# Altium project FIT_PM_Dual_Range_AFE.PrjPcb (part 4 of 8)

## Sheet AFE.SchDoc: FIT_PM12 board
size 420 x 297 mm; CheckedBy: G.Kasprowicz; Author: INR Moscow; CompanyName: WUT ISE; DrawnBy: M.Podgórski; Organization: WUT ISE; Address1: PW ISE; Address2: Nowowiejska 15/19 00-665 Warsaw; Address3: gkasprow@gmail.com; DocumentNumber: 2; Revision: 2; SheetNumber: 4; SheetTotal: 21; ModifiedBy: -; CheckedDate: -; Title2: AFEs; DivGrp: WUT ISE; Designer: INR RAS; ModifiedDate: -; ProjectName: Sensor Box
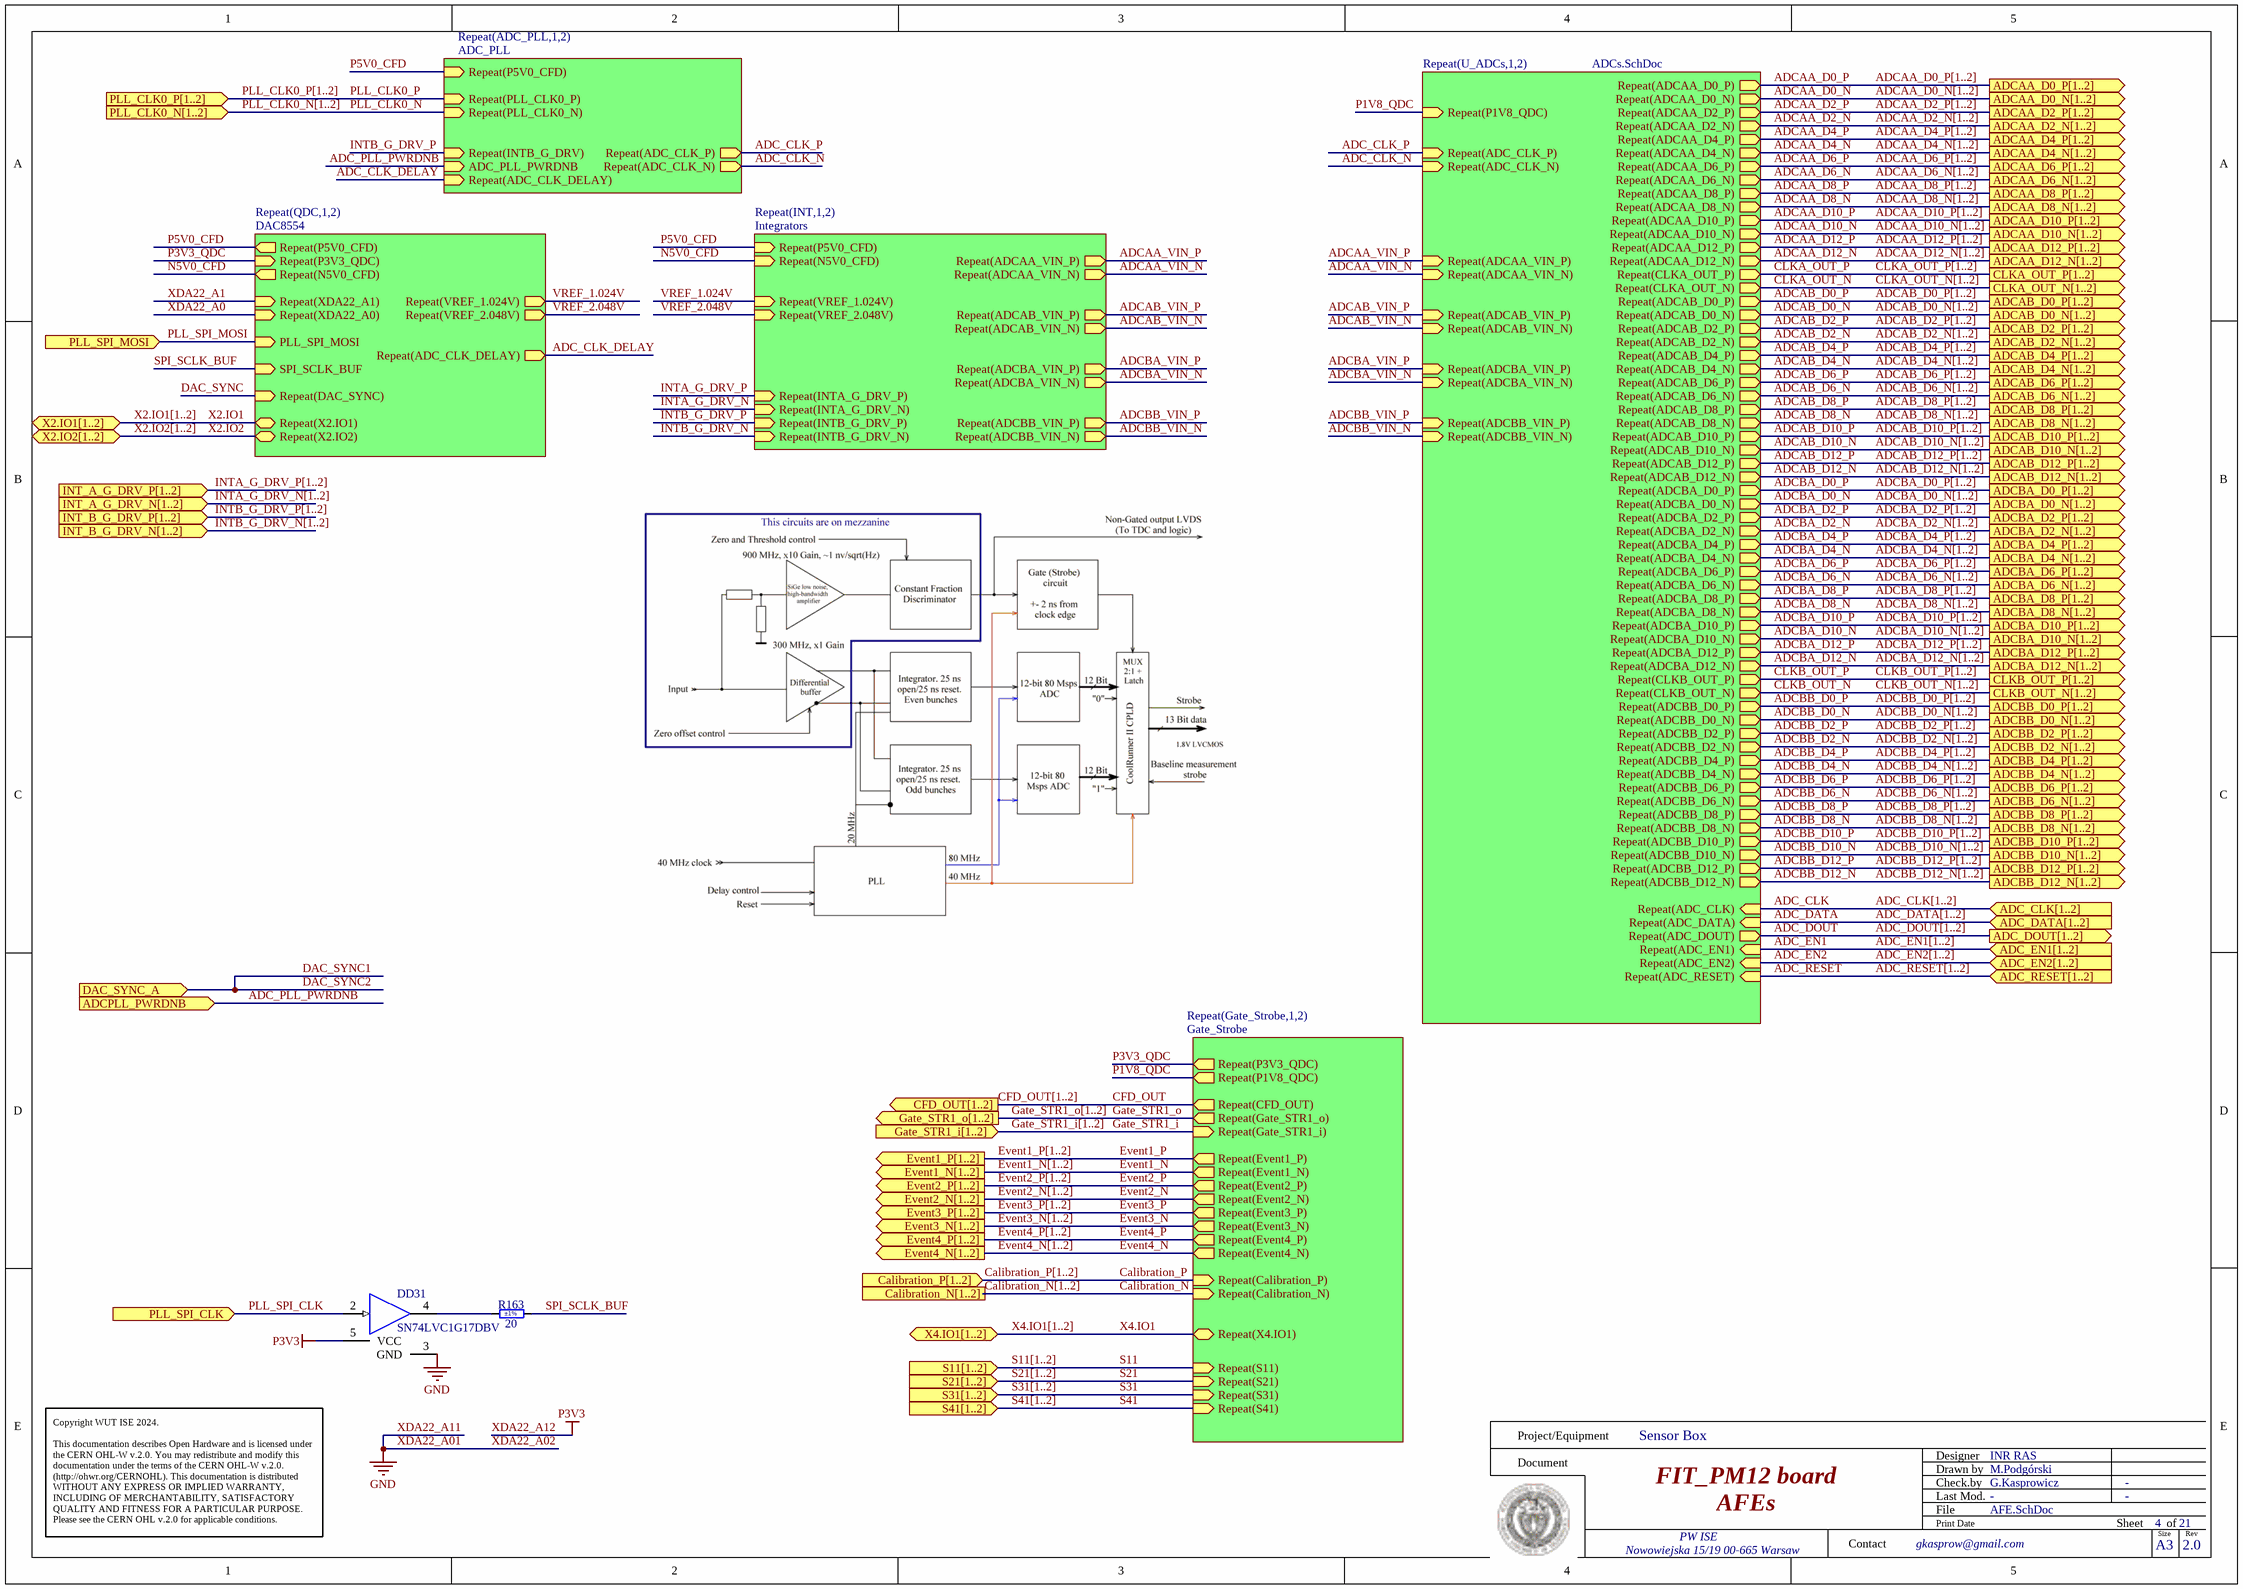
[diagram p12: AFE.SchDoc]

### Parts
DD31  SN74LVC1G17DBV  [SOT95P280X145-5N]
R163  20  Tolerance: ±1%  [RESC2012X60N]

### Sub-sheets
Repeat(ADC_PLL,1,2) = ADC_PLL: ADC_PLL_PWRDNB (in), Repeat(ADC_CLK_DELAY) (in), Repeat(P5V0_CFD) (in), Repeat(INTB_G_DRV) (in), Repeat(PLL_CLK0_P) (in), Repeat(PLL_CLK0_N) (in), Repeat(ADC_CLK_P) (out), Repeat(ADC_CLK_N) (out)
Repeat(Gate_Strobe,1,2) = Gate_Strobe: Repeat(Gate_STR1_i) (in), Repeat(Event1_P) (out), Repeat(Event1_N) (out), Repeat(P3V3_QDC) (out), Repeat(Gate_STR1_o) (out), Repeat(CFD_OUT) (out), Repeat(P1V8_QDC) (out), Repeat(X4.IO1) (bidir), Repeat(Event2_P) (out), Repeat(Event2_N) (out), Repeat(Event3_P) (out), Repeat(Event3_N) (out), Repeat(Event4_P) (out), Repeat(Event4_N) (out), Repeat(Calibration_P) (in), Repeat(Calibration_N) (in), Repeat(S11) (in), Repeat(S21) (in), Repeat(S31) (in), Repeat(S41) (in)
Repeat(INT,1,2) = Integrators: Repeat(N5V0_CFD) (in), Repeat(P5V0_CFD) (in), Repeat(INTA_G_DRV_N) (in), Repeat(INTB_G_DRV_P) (in), Repeat(VREF_2.048V) (in), Repeat(VREF_1.024V) (in), Repeat(ADCAA_VIN_P) (out), Repeat(ADCAA_VIN_N) (out), Repeat(ADCAB_VIN_P) (out), Repeat(ADCAB_VIN_N) (out), Repeat(ADCBA_VIN_P) (out), Repeat(ADCBA_VIN_N) (out), Repeat(ADCBB_VIN_P) (out), Repeat(ADCBB_VIN_N) (out), Repeat(INTB_G_DRV_N) (in), Repeat(INTA_G_DRV_P) (in)
Repeat(QDC,1,2) = DAC8554: Repeat(ADC_CLK_DELAY) (out), PLL_SPI_MOSI (in), SPI_SCLK_BUF (in), Repeat(DAC_SYNC) (in), Repeat(P5V0_CFD) (out), Repeat(N5V0_CFD) (out), Repeat(P3V3_QDC) (in), Repeat(VREF_2.048V) (out), Repeat(VREF_1.024V) (out), Repeat(XDA22_A1) (in), Repeat(XDA22_A0) (in), Repeat(X2.IO1) (bidir), Repeat(X2.IO2) (bidir)
Repeat(U_ADCs,1,2) = ADCs.SchDoc: Repeat(ADCAA_VIN_P) (in), Repeat(ADCAA_VIN_N) (in), Repeat(ADCAB_VIN_P) (in), Repeat(ADCAB_VIN_N) (in), Repeat(ADCBA_VIN_P) (in), Repeat(ADCBA_VIN_N) (in), Repeat(ADCBB_VIN_P) (in), Repeat(ADCBB_VIN_N) (in), Repeat(P1V8_QDC) (in), Repeat(ADCAA_D0_P) (out), Repeat(ADCAA_D0_N) (out), Repeat(ADCAA_D2_P) (out), Repeat(ADCAA_D2_N) (out), Repeat(ADCAA_D4_P) (out), Repeat(ADCAA_D4_N) (out), Repeat(ADCAA_D6_P) (out), Repeat(ADCAA_D6_N) (out), Repeat(ADCAA_D8_P) (out), Repeat(ADCAA_D8_N) (out), Repeat(ADCAA_D10_P) (out), Repeat(ADCAA_D10_N) (out), Repeat(ADCAA_D12_P) (out), Repeat(ADCAA_D12_N) (out), Repeat(CLKA_OUT_P) (out), Repeat(CLKA_OUT_N) (out), Repeat(ADCAB_D0_P) (out), Repeat(ADCAB_D0_N) (out), Repeat(ADCAB_D2_P) (out), Repeat(ADCAB_D2_N) (out), Repeat(ADCAB_D4_P) (out), Repeat(ADCAB_D4_N) (out), Repeat(ADCAB_D6_P) (out), Repeat(ADCAB_D6_N) (out), Repeat(ADCAB_D8_P) (out), Repeat(ADCAB_D8_N) (out), Repeat(ADCAB_D10_P) (out), Repeat(ADCAB_D10_N) (out), Repeat(ADCAB_D12_P) (out), Repeat(ADCAB_D12_N) (out), Repeat(ADCBA_D0_P) (out), Repeat(ADCBA_D0_N) (out), Repeat(ADCBA_D2_P) (out), Repeat(ADCBA_D2_N) (out), Repeat(ADCBA_D4_P) (out), Repeat(ADCBA_D4_N) (out), Repeat(ADCBA_D6_P) (out), Repeat(ADCBA_D6_N) (out), Repeat(ADCBA_D8_P) (out), Repeat(ADCBA_D8_N) (out), Repeat(ADCBA_D10_P) (out), Repeat(ADCBA_D10_N) (out), Repeat(ADCBA_D12_P) (out), Repeat(ADCBA_D12_N) (out), Repeat(CLKB_OUT_P) (out), Repeat(CLKB_OUT_N) (out), Repeat(ADCBB_D0_P) (out), Repeat(ADCBB_D0_N) (out), Repeat(ADCBB_D2_P) (out), Repeat(ADCBB_D2_N) (out), Repeat(ADCBB_D4_P) (out), Repeat(ADCBB_D4_N) (out), Repeat(ADCBB_D6_P) (out), Repeat(ADCBB_D6_N) (out), Repeat(ADCBB_D8_P) (out), Repeat(ADCBB_D8_N) (out), Repeat(ADCBB_D10_P) (out), Repeat(ADCBB_D10_N) (out), Repeat(ADCBB_D12_P) (out), Repeat(ADCBB_D12_N) (out), Repeat(ADC_CLK_N) (in), Repeat(ADC_CLK_P) (in), Repeat(ADC_CLK) (in), Repeat(ADC_DATA) (in), Repeat(ADC_DOUT) (out), Repeat(ADC_EN1) (in), Repeat(ADC_EN2) (in), Repeat(ADC_RESET) (in)

### Ports
ADC_CLK[1..2] (in), ADC_DATA[1..2] (in), ADC_DOUT[1..2] (out), ADC_EN1[1..2] (in), ADC_EN2[1..2] (in), ADC_RESET[1..2] (in), ADCAA_D0_N[1..2] (out), ADCAA_D0_P[1..2] (out), ADCAA_D2_N[1..2] (out), ADCAA_D2_P[1..2] (out), ADCAA_D4_N[1..2] (out), ADCAA_D4_P[1..2] (out), ADCAA_D6_N[1..2] (out), ADCAA_D6_P[1..2] (out), ADCAA_D8_N[1..2] (out), ADCAA_D8_P[1..2] (out), ADCAA_D10_N[1..2] (out), ADCAA_D10_P[1..2] (out), ADCAA_D12_N[1..2] (out), ADCAA_D12_P[1..2] (out), ADCAB_D0_N[1..2] (out), ADCAB_D0_P[1..2] (out), ADCAB_D2_N[1..2] (out), ADCAB_D2_P[1..2] (out), ADCAB_D4_N[1..2] (out), ADCAB_D4_P[1..2] (out), ADCAB_D6_N[1..2] (out), ADCAB_D6_P[1..2] (out), ADCAB_D8_N[1..2] (out), ADCAB_D8_P[1..2] (out), ADCAB_D10_N[1..2] (out), ADCAB_D10_P[1..2] (out), ADCAB_D12_N[1..2] (out), ADCAB_D12_P[1..2] (out), ADCBA_D0_N[1..2] (out), ADCBA_D0_P[1..2] (out), ADCBA_D2_N[1..2] (out), ADCBA_D2_P[1..2] (out), ADCBA_D4_N[1..2] (out), ADCBA_D4_P[1..2] (out), ADCBA_D6_N[1..2] (out), ADCBA_D6_P[1..2] (out), ADCBA_D8_N[1..2] (out), ADCBA_D8_P[1..2] (out), ADCBA_D10_N[1..2] (out), ADCBA_D10_P[1..2] (out), ADCBA_D12_N[1..2] (out), ADCBA_D12_P[1..2] (out), ADCBB_D0_N[1..2] (out), ADCBB_D0_P[1..2] (out), ADCBB_D2_N[1..2] (out), ADCBB_D2_P[1..2] (out), ADCBB_D4_N[1..2] (out), ADCBB_D4_P[1..2] (out), ADCBB_D6_N[1..2] (out), ADCBB_D6_P[1..2] (out), ADCBB_D8_N[1..2] (out), ADCBB_D8_P[1..2] (out), ADCBB_D10_N[1..2] (out), ADCBB_D10_P[1..2] (out), ADCBB_D12_N[1..2] (out), ADCBB_D12_P[1..2] (out), ADCPLL_PWRDNB (in), Calibration_N[1..2] (in), Calibration_P[1..2] (in), CFD_OUT[1..2] (out), CLKA_OUT_N[1..2] (out), CLKA_OUT_P[1..2] (out), CLKB_OUT_N[1..2] (out), CLKB_OUT_P[1..2] (out), DAC_SYNC_A (in), Event1_N[1..2] (out), Event1_P[1..2] (out), Event2_N[1..2] (out), Event2_P[1..2] (out), Event3_N[1..2] (out), Event3_P[1..2] (out), Event4_N[1..2] (out), Event4_P[1..2] (out), Gate_STR1_i[1..2] (in), Gate_STR1_o[1..2] (out), INT_A_G_DRV_N[1..2] (in), INT_A_G_DRV_P[1..2] (in), INT_B_G_DRV_N[1..2] (in), INT_B_G_DRV_P[1..2] (in), PLL_CLK0_N[1..2] (in), PLL_CLK0_P[1..2] (in), PLL_SPI_CLK (in), PLL_SPI_MOSI (in), S11[1..2] (in), S21[1..2] (in), S31[1..2] (in), S41[1..2] (in), X2.IO1[1..2] (bidir), X2.IO2[1..2] (bidir), X4.IO1[1..2] (bidir)

### Nets
GND: DD31.3(GND)  [also labelled XDA22_A01, XDA22_A02, XDA22_A11]
P3V3: DD31.5(VCC)  [also labelled XDA22_A12]
ADC_CLK: sheet Repeat(U_ADCs,1,2)/Repeat(ADC_CLK)
ADC_CLK_DELAY: sheet Repeat(QDC,1,2)/Repeat(ADC_CLK_DELAY), sheet Repeat(ADC_PLL,1,2)/Repeat(ADC_CLK_DELAY)
ADC_CLK_N: sheet Repeat(ADC_PLL,1,2)/Repeat(ADC_CLK_N), sheet Repeat(U_ADCs,1,2)/Repeat(ADC_CLK_N)
ADC_CLK_P: sheet Repeat(ADC_PLL,1,2)/Repeat(ADC_CLK_P), sheet Repeat(U_ADCs,1,2)/Repeat(ADC_CLK_P)
ADC_DATA: sheet Repeat(U_ADCs,1,2)/Repeat(ADC_DATA)
ADC_DOUT: sheet Repeat(U_ADCs,1,2)/Repeat(ADC_DOUT)
ADC_EN1: sheet Repeat(U_ADCs,1,2)/Repeat(ADC_EN1)
ADC_EN2: sheet Repeat(U_ADCs,1,2)/Repeat(ADC_EN2)
ADC_PLL_PWRDNB: port ADCPLL_PWRDNB, sheet Repeat(ADC_PLL,1,2)/ADC_PLL_PWRDNB
ADC_RESET: sheet Repeat(U_ADCs,1,2)/Repeat(ADC_RESET)
ADCAA_D0_N: sheet Repeat(U_ADCs,1,2)/Repeat(ADCAA_D0_N)
ADCAA_D0_P: sheet Repeat(U_ADCs,1,2)/Repeat(ADCAA_D0_P)
ADCAA_D2_N: sheet Repeat(U_ADCs,1,2)/Repeat(ADCAA_D2_N)
ADCAA_D2_P: sheet Repeat(U_ADCs,1,2)/Repeat(ADCAA_D2_P)
ADCAA_D4_N: sheet Repeat(U_ADCs,1,2)/Repeat(ADCAA_D4_N)
ADCAA_D4_P: sheet Repeat(U_ADCs,1,2)/Repeat(ADCAA_D4_P)
ADCAA_D6_N: sheet Repeat(U_ADCs,1,2)/Repeat(ADCAA_D6_N)
ADCAA_D6_P: sheet Repeat(U_ADCs,1,2)/Repeat(ADCAA_D6_P)
ADCAA_D8_N: sheet Repeat(U_ADCs,1,2)/Repeat(ADCAA_D8_N)
ADCAA_D8_P: sheet Repeat(U_ADCs,1,2)/Repeat(ADCAA_D8_P)
ADCAA_D10_N: sheet Repeat(U_ADCs,1,2)/Repeat(ADCAA_D10_N)
ADCAA_D10_P: sheet Repeat(U_ADCs,1,2)/Repeat(ADCAA_D10_P)
ADCAA_D12_N: sheet Repeat(U_ADCs,1,2)/Repeat(ADCAA_D12_N)
ADCAA_D12_P: sheet Repeat(U_ADCs,1,2)/Repeat(ADCAA_D12_P)
ADCAA_VIN_N: sheet Repeat(INT,1,2)/Repeat(ADCAA_VIN_N), sheet Repeat(U_ADCs,1,2)/Repeat(ADCAA_VIN_N)
ADCAA_VIN_P: sheet Repeat(INT,1,2)/Repeat(ADCAA_VIN_P), sheet Repeat(U_ADCs,1,2)/Repeat(ADCAA_VIN_P)
ADCAB_D0_N: sheet Repeat(U_ADCs,1,2)/Repeat(ADCAB_D0_N)
ADCAB_D0_P: sheet Repeat(U_ADCs,1,2)/Repeat(ADCAB_D0_P)
ADCAB_D2_N: sheet Repeat(U_ADCs,1,2)/Repeat(ADCAB_D2_N)
ADCAB_D2_P: sheet Repeat(U_ADCs,1,2)/Repeat(ADCAB_D2_P)
ADCAB_D4_N: sheet Repeat(U_ADCs,1,2)/Repeat(ADCAB_D4_N)
ADCAB_D4_P: sheet Repeat(U_ADCs,1,2)/Repeat(ADCAB_D4_P)
ADCAB_D6_N: sheet Repeat(U_ADCs,1,2)/Repeat(ADCAB_D6_N)
ADCAB_D6_P: sheet Repeat(U_ADCs,1,2)/Repeat(ADCAB_D6_P)
ADCAB_D8_N: sheet Repeat(U_ADCs,1,2)/Repeat(ADCAB_D8_N)
ADCAB_D8_P: sheet Repeat(U_ADCs,1,2)/Repeat(ADCAB_D8_P)
ADCAB_D10_N: sheet Repeat(U_ADCs,1,2)/Repeat(ADCAB_D10_N)
ADCAB_D10_P: sheet Repeat(U_ADCs,1,2)/Repeat(ADCAB_D10_P)
ADCAB_D12_N: sheet Repeat(U_ADCs,1,2)/Repeat(ADCAB_D12_N)
ADCAB_D12_P: sheet Repeat(U_ADCs,1,2)/Repeat(ADCAB_D12_P)
ADCAB_VIN_N: sheet Repeat(INT,1,2)/Repeat(ADCAB_VIN_N), sheet Repeat(U_ADCs,1,2)/Repeat(ADCAB_VIN_N)
ADCAB_VIN_P: sheet Repeat(INT,1,2)/Repeat(ADCAB_VIN_P), sheet Repeat(U_ADCs,1,2)/Repeat(ADCAB_VIN_P)
ADCBA_D0_N: sheet Repeat(U_ADCs,1,2)/Repeat(ADCBA_D0_N)
ADCBA_D0_P: sheet Repeat(U_ADCs,1,2)/Repeat(ADCBA_D0_P)
ADCBA_D2_N: sheet Repeat(U_ADCs,1,2)/Repeat(ADCBA_D2_N)
ADCBA_D2_P: sheet Repeat(U_ADCs,1,2)/Repeat(ADCBA_D2_P)
ADCBA_D4_N: sheet Repeat(U_ADCs,1,2)/Repeat(ADCBA_D4_N)
ADCBA_D4_P: sheet Repeat(U_ADCs,1,2)/Repeat(ADCBA_D4_P)
ADCBA_D6_N: sheet Repeat(U_ADCs,1,2)/Repeat(ADCBA_D6_N)
ADCBA_D6_P: sheet Repeat(U_ADCs,1,2)/Repeat(ADCBA_D6_P)
ADCBA_D8_N: sheet Repeat(U_ADCs,1,2)/Repeat(ADCBA_D8_N)
ADCBA_D8_P: sheet Repeat(U_ADCs,1,2)/Repeat(ADCBA_D8_P)
ADCBA_D10_N: sheet Repeat(U_ADCs,1,2)/Repeat(ADCBA_D10_N)
ADCBA_D10_P: sheet Repeat(U_ADCs,1,2)/Repeat(ADCBA_D10_P)
ADCBA_D12_N: sheet Repeat(U_ADCs,1,2)/Repeat(ADCBA_D12_N)
ADCBA_D12_P: sheet Repeat(U_ADCs,1,2)/Repeat(ADCBA_D12_P)
ADCBA_VIN_N: sheet Repeat(INT,1,2)/Repeat(ADCBA_VIN_N), sheet Repeat(U_ADCs,1,2)/Repeat(ADCBA_VIN_N)
ADCBA_VIN_P: sheet Repeat(INT,1,2)/Repeat(ADCBA_VIN_P), sheet Repeat(U_ADCs,1,2)/Repeat(ADCBA_VIN_P)
ADCBB_D0_N: sheet Repeat(U_ADCs,1,2)/Repeat(ADCBB_D0_N)
ADCBB_D0_P: sheet Repeat(U_ADCs,1,2)/Repeat(ADCBB_D0_P)
ADCBB_D2_N: sheet Repeat(U_ADCs,1,2)/Repeat(ADCBB_D2_N)
ADCBB_D2_P: sheet Repeat(U_ADCs,1,2)/Repeat(ADCBB_D2_P)
ADCBB_D4_N: sheet Repeat(U_ADCs,1,2)/Repeat(ADCBB_D4_N)
ADCBB_D4_P: sheet Repeat(U_ADCs,1,2)/Repeat(ADCBB_D4_P)
ADCBB_D6_N: sheet Repeat(U_ADCs,1,2)/Repeat(ADCBB_D6_N)
ADCBB_D6_P: sheet Repeat(U_ADCs,1,2)/Repeat(ADCBB_D6_P)
ADCBB_D8_N: sheet Repeat(U_ADCs,1,2)/Repeat(ADCBB_D8_N)
ADCBB_D8_P: sheet Repeat(U_ADCs,1,2)/Repeat(ADCBB_D8_P)
ADCBB_D10_N: sheet Repeat(U_ADCs,1,2)/Repeat(ADCBB_D10_N)
ADCBB_D10_P: sheet Repeat(U_ADCs,1,2)/Repeat(ADCBB_D10_P)
ADCBB_D12_N: sheet Repeat(U_ADCs,1,2)/Repeat(ADCBB_D12_N)
ADCBB_D12_P: sheet Repeat(U_ADCs,1,2)/Repeat(ADCBB_D12_P)
ADCBB_VIN_N: sheet Repeat(INT,1,2)/Repeat(ADCBB_VIN_N), sheet Repeat(U_ADCs,1,2)/Repeat(ADCBB_VIN_N)
ADCBB_VIN_P: sheet Repeat(INT,1,2)/Repeat(ADCBB_VIN_P), sheet Repeat(U_ADCs,1,2)/Repeat(ADCBB_VIN_P)
Calibration_N: sheet Repeat(Gate_Strobe,1,2)/Repeat(Calibration_N)
Calibration_P: sheet Repeat(Gate_Strobe,1,2)/Repeat(Calibration_P)
CFD_OUT: sheet Repeat(Gate_Strobe,1,2)/Repeat(CFD_OUT)
CLKA_OUT_N: sheet Repeat(U_ADCs,1,2)/Repeat(CLKA_OUT_N)
CLKA_OUT_P: sheet Repeat(U_ADCs,1,2)/Repeat(CLKA_OUT_P)
CLKB_OUT_N: sheet Repeat(U_ADCs,1,2)/Repeat(CLKB_OUT_N)
CLKB_OUT_P: sheet Repeat(U_ADCs,1,2)/Repeat(CLKB_OUT_P)
DAC_SYNC: sheet Repeat(QDC,1,2)/Repeat(DAC_SYNC)
Event1_N: sheet Repeat(Gate_Strobe,1,2)/Repeat(Event1_N)
Event1_P: sheet Repeat(Gate_Strobe,1,2)/Repeat(Event1_P)
Event2_N: sheet Repeat(Gate_Strobe,1,2)/Repeat(Event2_N)
Event2_P: sheet Repeat(Gate_Strobe,1,2)/Repeat(Event2_P)
Event3_N: sheet Repeat(Gate_Strobe,1,2)/Repeat(Event3_N)
Event3_P: sheet Repeat(Gate_Strobe,1,2)/Repeat(Event3_P)
Event4_N: sheet Repeat(Gate_Strobe,1,2)/Repeat(Event4_N)
Event4_P: sheet Repeat(Gate_Strobe,1,2)/Repeat(Event4_P)
Gate_STR1_i: sheet Repeat(Gate_Strobe,1,2)/Repeat(Gate_STR1_i)
Gate_STR1_o: sheet Repeat(Gate_Strobe,1,2)/Repeat(Gate_STR1_o)
INTA_G_DRV_N: sheet Repeat(INT,1,2)/Repeat(INTA_G_DRV_N)
INTA_G_DRV_P: sheet Repeat(INT,1,2)/Repeat(INTA_G_DRV_P)
INTB_G_DRV_N: sheet Repeat(INT,1,2)/Repeat(INTB_G_DRV_N)
INTB_G_DRV_P: sheet Repeat(INT,1,2)/Repeat(INTB_G_DRV_P), sheet Repeat(ADC_PLL,1,2)/Repeat(INTB_G_DRV)
N5V0_CFD: sheet Repeat(INT,1,2)/Repeat(N5V0_CFD), sheet Repeat(QDC,1,2)/Repeat(N5V0_CFD)
P1V8_QDC: sheet Repeat(Gate_Strobe,1,2)/Repeat(P1V8_QDC), sheet Repeat(U_ADCs,1,2)/Repeat(P1V8_QDC)
P3V3_QDC: sheet Repeat(QDC,1,2)/Repeat(P3V3_QDC), sheet Repeat(Gate_Strobe,1,2)/Repeat(P3V3_QDC)
P5V0_CFD: sheet Repeat(INT,1,2)/Repeat(P5V0_CFD), sheet Repeat(QDC,1,2)/Repeat(P5V0_CFD), sheet Repeat(ADC_PLL,1,2)/Repeat(P5V0_CFD)
PLL_CLK0_N: sheet Repeat(ADC_PLL,1,2)/Repeat(PLL_CLK0_N)
PLL_CLK0_P: sheet Repeat(ADC_PLL,1,2)/Repeat(PLL_CLK0_P)
PLL_SPI_CLK: DD31.2(IN) ; port PLL_SPI_CLK
PLL_SPI_MOSI: port PLL_SPI_MOSI, sheet Repeat(QDC,1,2)/PLL_SPI_MOSI
S11: sheet Repeat(Gate_Strobe,1,2)/Repeat(S11)
S21: sheet Repeat(Gate_Strobe,1,2)/Repeat(S21)
S31: sheet Repeat(Gate_Strobe,1,2)/Repeat(S31)
S41: sheet Repeat(Gate_Strobe,1,2)/Repeat(S41)
SPI_SCLK_BUF: R163.2 ; sheet Repeat(QDC,1,2)/SPI_SCLK_BUF
VREF_1.024V: sheet Repeat(INT,1,2)/Repeat(VREF_1.024V), sheet Repeat(QDC,1,2)/Repeat(VREF_1.024V)
VREF_2.048V: sheet Repeat(INT,1,2)/Repeat(VREF_2.048V), sheet Repeat(QDC,1,2)/Repeat(VREF_2.048V)
X2.IO1: sheet Repeat(QDC,1,2)/Repeat(X2.IO1)
X2.IO2: sheet Repeat(QDC,1,2)/Repeat(X2.IO2)
X4.IO1: sheet Repeat(Gate_Strobe,1,2)/Repeat(X4.IO1)
XDA22_A0: sheet Repeat(QDC,1,2)/Repeat(XDA22_A0)
XDA22_A1: sheet Repeat(QDC,1,2)/Repeat(XDA22_A1)
NetDD31_4: DD31.4(OUT) R163.1

### Buses and harness runs
bus ADC_CLK[1..2] = port ADC_CLK[1..2]
bus ADC_DATA[1..2] = port ADC_DATA[1..2]
bus ADC_DOUT[1..2] = port ADC_DOUT[1..2]
bus ADC_EN1[1..2] = port ADC_EN1[1..2]
bus ADC_EN2[1..2] = port ADC_EN2[1..2]
bus ADC_RESET[1..2] = port ADC_RESET[1..2]
bus ADCAA_D0_N[1..2] = port ADCAA_D0_N[1..2]
bus ADCAA_D0_P[1..2] = port ADCAA_D0_P[1..2]
bus ADCAA_D2_N[1..2] = port ADCAA_D2_N[1..2]
bus ADCAA_D2_P[1..2] = port ADCAA_D2_P[1..2]
bus ADCAA_D4_N[1..2] = port ADCAA_D4_N[1..2]
bus ADCAA_D4_P[1..2] = port ADCAA_D4_P[1..2]
bus ADCAA_D6_N[1..2] = port ADCAA_D6_N[1..2]
bus ADCAA_D6_P[1..2] = port ADCAA_D6_P[1..2]
bus ADCAA_D8_N[1..2] = port ADCAA_D8_N[1..2]
bus ADCAA_D8_P[1..2] = port ADCAA_D8_P[1..2]
bus ADCAA_D10_N[1..2] = port ADCAA_D10_N[1..2]
bus ADCAA_D10_P[1..2] = port ADCAA_D10_P[1..2]
bus ADCAA_D12_N[1..2] = port ADCAA_D12_N[1..2]
bus ADCAA_D12_P[1..2] = port ADCAA_D12_P[1..2]
bus ADCAB_D0_N[1..2] = port ADCAB_D0_N[1..2]
bus ADCAB_D0_P[1..2] = port ADCAB_D0_P[1..2]
bus ADCAB_D2_N[1..2] = port ADCAB_D2_N[1..2]
bus ADCAB_D2_P[1..2] = port ADCAB_D2_P[1..2]
bus ADCAB_D4_N[1..2] = port ADCAB_D4_N[1..2]
bus ADCAB_D4_P[1..2] = port ADCAB_D4_P[1..2]
bus ADCAB_D6_N[1..2] = port ADCAB_D6_N[1..2]
bus ADCAB_D6_P[1..2] = port ADCAB_D6_P[1..2]
bus ADCAB_D8_N[1..2] = port ADCAB_D8_N[1..2]
bus ADCAB_D8_P[1..2] = port ADCAB_D8_P[1..2]
bus ADCAB_D10_N[1..2] = port ADCAB_D10_N[1..2]
bus ADCAB_D10_P[1..2] = port ADCAB_D10_P[1..2]
bus ADCAB_D12_N[1..2] = port ADCAB_D12_N[1..2]
bus ADCAB_D12_P[1..2] = port ADCAB_D12_P[1..2]
bus ADCBA_D0_N[1..2] = port ADCBA_D0_N[1..2]
bus ADCBA_D0_P[1..2] = port ADCBA_D0_P[1..2]
bus ADCBA_D2_N[1..2] = port ADCBA_D2_N[1..2]
bus ADCBA_D2_P[1..2] = port ADCBA_D2_P[1..2]
bus ADCBA_D4_N[1..2] = port ADCBA_D4_N[1..2]
bus ADCBA_D4_P[1..2] = port ADCBA_D4_P[1..2]
bus ADCBA_D6_N[1..2] = port ADCBA_D6_N[1..2]
bus ADCBA_D6_P[1..2] = port ADCBA_D6_P[1..2]
bus ADCBA_D8_N[1..2] = port ADCBA_D8_N[1..2]
bus ADCBA_D8_P[1..2] = port ADCBA_D8_P[1..2]
bus ADCBA_D10_N[1..2] = port ADCBA_D10_N[1..2]
bus ADCBA_D10_P[1..2] = port ADCBA_D10_P[1..2]
bus ADCBA_D12_N[1..2] = port ADCBA_D12_N[1..2]
bus ADCBA_D12_P[1..2] = port ADCBA_D12_P[1..2]
bus ADCBB_D0_N[1..2] = port ADCBB_D0_N[1..2]
bus ADCBB_D0_P[1..2] = port ADCBB_D0_P[1..2]
bus ADCBB_D2_N[1..2] = port ADCBB_D2_N[1..2]
bus ADCBB_D2_P[1..2] = port ADCBB_D2_P[1..2]
bus ADCBB_D4_N[1..2] = port ADCBB_D4_N[1..2]
bus ADCBB_D4_P[1..2] = port ADCBB_D4_P[1..2]
bus ADCBB_D6_N[1..2] = port ADCBB_D6_N[1..2]
bus ADCBB_D6_P[1..2] = port ADCBB_D6_P[1..2]
bus ADCBB_D8_N[1..2] = port ADCBB_D8_N[1..2]
bus ADCBB_D8_P[1..2] = port ADCBB_D8_P[1..2]
bus ADCBB_D10_N[1..2] = port ADCBB_D10_N[1..2]
bus ADCBB_D10_P[1..2] = port ADCBB_D10_P[1..2]
bus ADCBB_D12_N[1..2] = port ADCBB_D12_N[1..2]
bus ADCBB_D12_P[1..2] = port ADCBB_D12_P[1..2]
bus Calibration_N[1..2] = port Calibration_N[1..2]
bus Calibration_P[1..2] = port Calibration_P[1..2]
bus CFD_OUT[1..2] = port CFD_OUT[1..2]
bus CLKA_OUT_N[1..2] = port CLKA_OUT_N[1..2]
bus CLKA_OUT_P[1..2] = port CLKA_OUT_P[1..2]
bus CLKB_OUT_N[1..2] = port CLKB_OUT_N[1..2]
bus CLKB_OUT_P[1..2] = port CLKB_OUT_P[1..2]
bus Event1_N[1..2] = port Event1_N[1..2]
bus Event1_P[1..2] = port Event1_P[1..2]
bus Event2_N[1..2] = port Event2_N[1..2]
bus Event2_P[1..2] = port Event2_P[1..2]
bus Event3_N[1..2] = port Event3_N[1..2]
bus Event3_P[1..2] = port Event3_P[1..2]
bus Event4_N[1..2] = port Event4_N[1..2]
bus Event4_P[1..2] = port Event4_P[1..2]
bus Gate_STR1_i[1..2] = port Gate_STR1_i[1..2]
bus Gate_STR1_o[1..2] = port Gate_STR1_o[1..2]
bus INTA_G_DRV_N[1..2] = port INT_A_G_DRV_N[1..2]
bus INTA_G_DRV_P[1..2] = port INT_A_G_DRV_P[1..2]
bus INTB_G_DRV_N[1..2] = port INT_B_G_DRV_N[1..2]
bus INTB_G_DRV_P[1..2] = port INT_B_G_DRV_P[1..2]
bus PLL_CLK0_N[1..2] = port PLL_CLK0_N[1..2]
bus PLL_CLK0_P[1..2] = port PLL_CLK0_P[1..2]
bus S11[1..2] = port S11[1..2]
bus S21[1..2] = port S21[1..2]
bus S31[1..2] = port S31[1..2]
bus S41[1..2] = port S41[1..2]
bus X2.IO1[1..2] = port X2.IO1[1..2]
bus X2.IO2[1..2] = port X2.IO2[1..2]
bus X4.IO1[1..2] = port X4.IO1[1..2]

### Notes on the sheet
- Project/Equipment
- Document
- Designer
- Drawn by
- Check.by
- Copyright WUT ISE 2024.
  This documentation describes Open Hardware and is licensed under the CERN OHL-W v.2.0. You may redistribute and modify this documentation under the terms of the CERN OHL-W v.2.0. (http://ohwr.org/CERNOHL). This documentation is distributed WITHOUT ANY EXPRESS OR IMPLIED WARRANTY, INCLUDING OF MERCHANTABILITY, SATISFACTORY QUALITY AND FITNESS FOR A PARTICULAR PURPOSE. Please see the CERN OHL v.2.0 for applicable conditions.
- Contact
- File
- Last Mod.
- Print Date
- Sheet
- Size
- A3
- of
- Rev

### Library data of the parts
DD31 = SN74LVC1G17DBVR: Single Schmitt-Trigger Buffer; Manufacturer: TEXAS INSTRUMENTS; PressFit: No; Bonding: No; Part Number: SN74LVC1G17DBVR; Component Kind: Standard; Component Type: Standard; Device: SN74LVC1G17DBV; PackageDescription: SOT, 0.95mm Pitch; 5 Pin, 1.60mm W X 2.90mm L X 1.45mm H body, IPC Medium Density; Part Description: Single Schmitt-Trigger Buffer; Manufacturer Part Number: SN74LVC1G17DBV; Pin Count: 5; Case: SOT23-5; Mounted: Yes; Socket: No; SMD: Yes; Sense: No; ComponentHeight: 1.45mm; Author: CERN DEM JLC; HelpURL: \\cern.ch\dfs\Applications\Altium\Datasheets\SN74LVC1G17DBVR.pdf; CreateDate: 06.11.2012; LatestRevisionDate: 06.11.2012
R163 = R0805_20R_1%_0.125W_100PPM: Resistor - 1%; Part Description: General Purpose Thick Film Chip Resistor; Manufacturer: GENERIC; Manufacturer1 Part Number: NRC10F20R0TRF; Power: 0.125W; TC: ±100ppm/°C; PressFit: No; Part Number: R0805_20R_1%_0.125W_100PPM; Component Kind: Standard; Component Type: Standard; Pin Count: 2; Value: 20; Status: Preferred; Manufacturer Part Number: R0805_20R_1%_0.125W_100PPM; Case: 0805; Mounted: Yes; Sense: No; Socket: No; SMD: Yes; Manufacturer1 Example: NIC COMPONENT; Manufacturer1 ComponentHeight: 0.6mm; HelpURL: \\cern.ch\dfs\Applications\Altium\Datasheets\R0805_NIC_NRC.pdf; Author: CERN DEM JLC; CreateDate: 03.12.2007; LatestRevisionDate: 13.03.2008

## Sheet Integrators.SchDoc: FIT_PM12 board
size 420 x 297 mm; CheckedBy: G.Kasprowicz; Author: INR Moscow; CompanyName: WUT ISE; DrawnBy: M.Podgórski; Organization: WUT ISE; Address1: PW ISE; Address2: Nowowiejska 15/19 00-665 Warsaw; Address3: gkasprow@gmail.com; DocumentNumber: 3; Revision: 2; SheetNumber: 5; SheetTotal: 21; ModifiedBy: -; CheckedDate: -; Title2: Integrators; DivGrp: WUT ISE; Designer: INR RAS; ModifiedDate: -; ProjectName: Sensor Box
Used 2 times, as channels U_AFE/INT1, U_AFE/INT2. Parts and nets are listed once, with the designators drawn on the sheet.
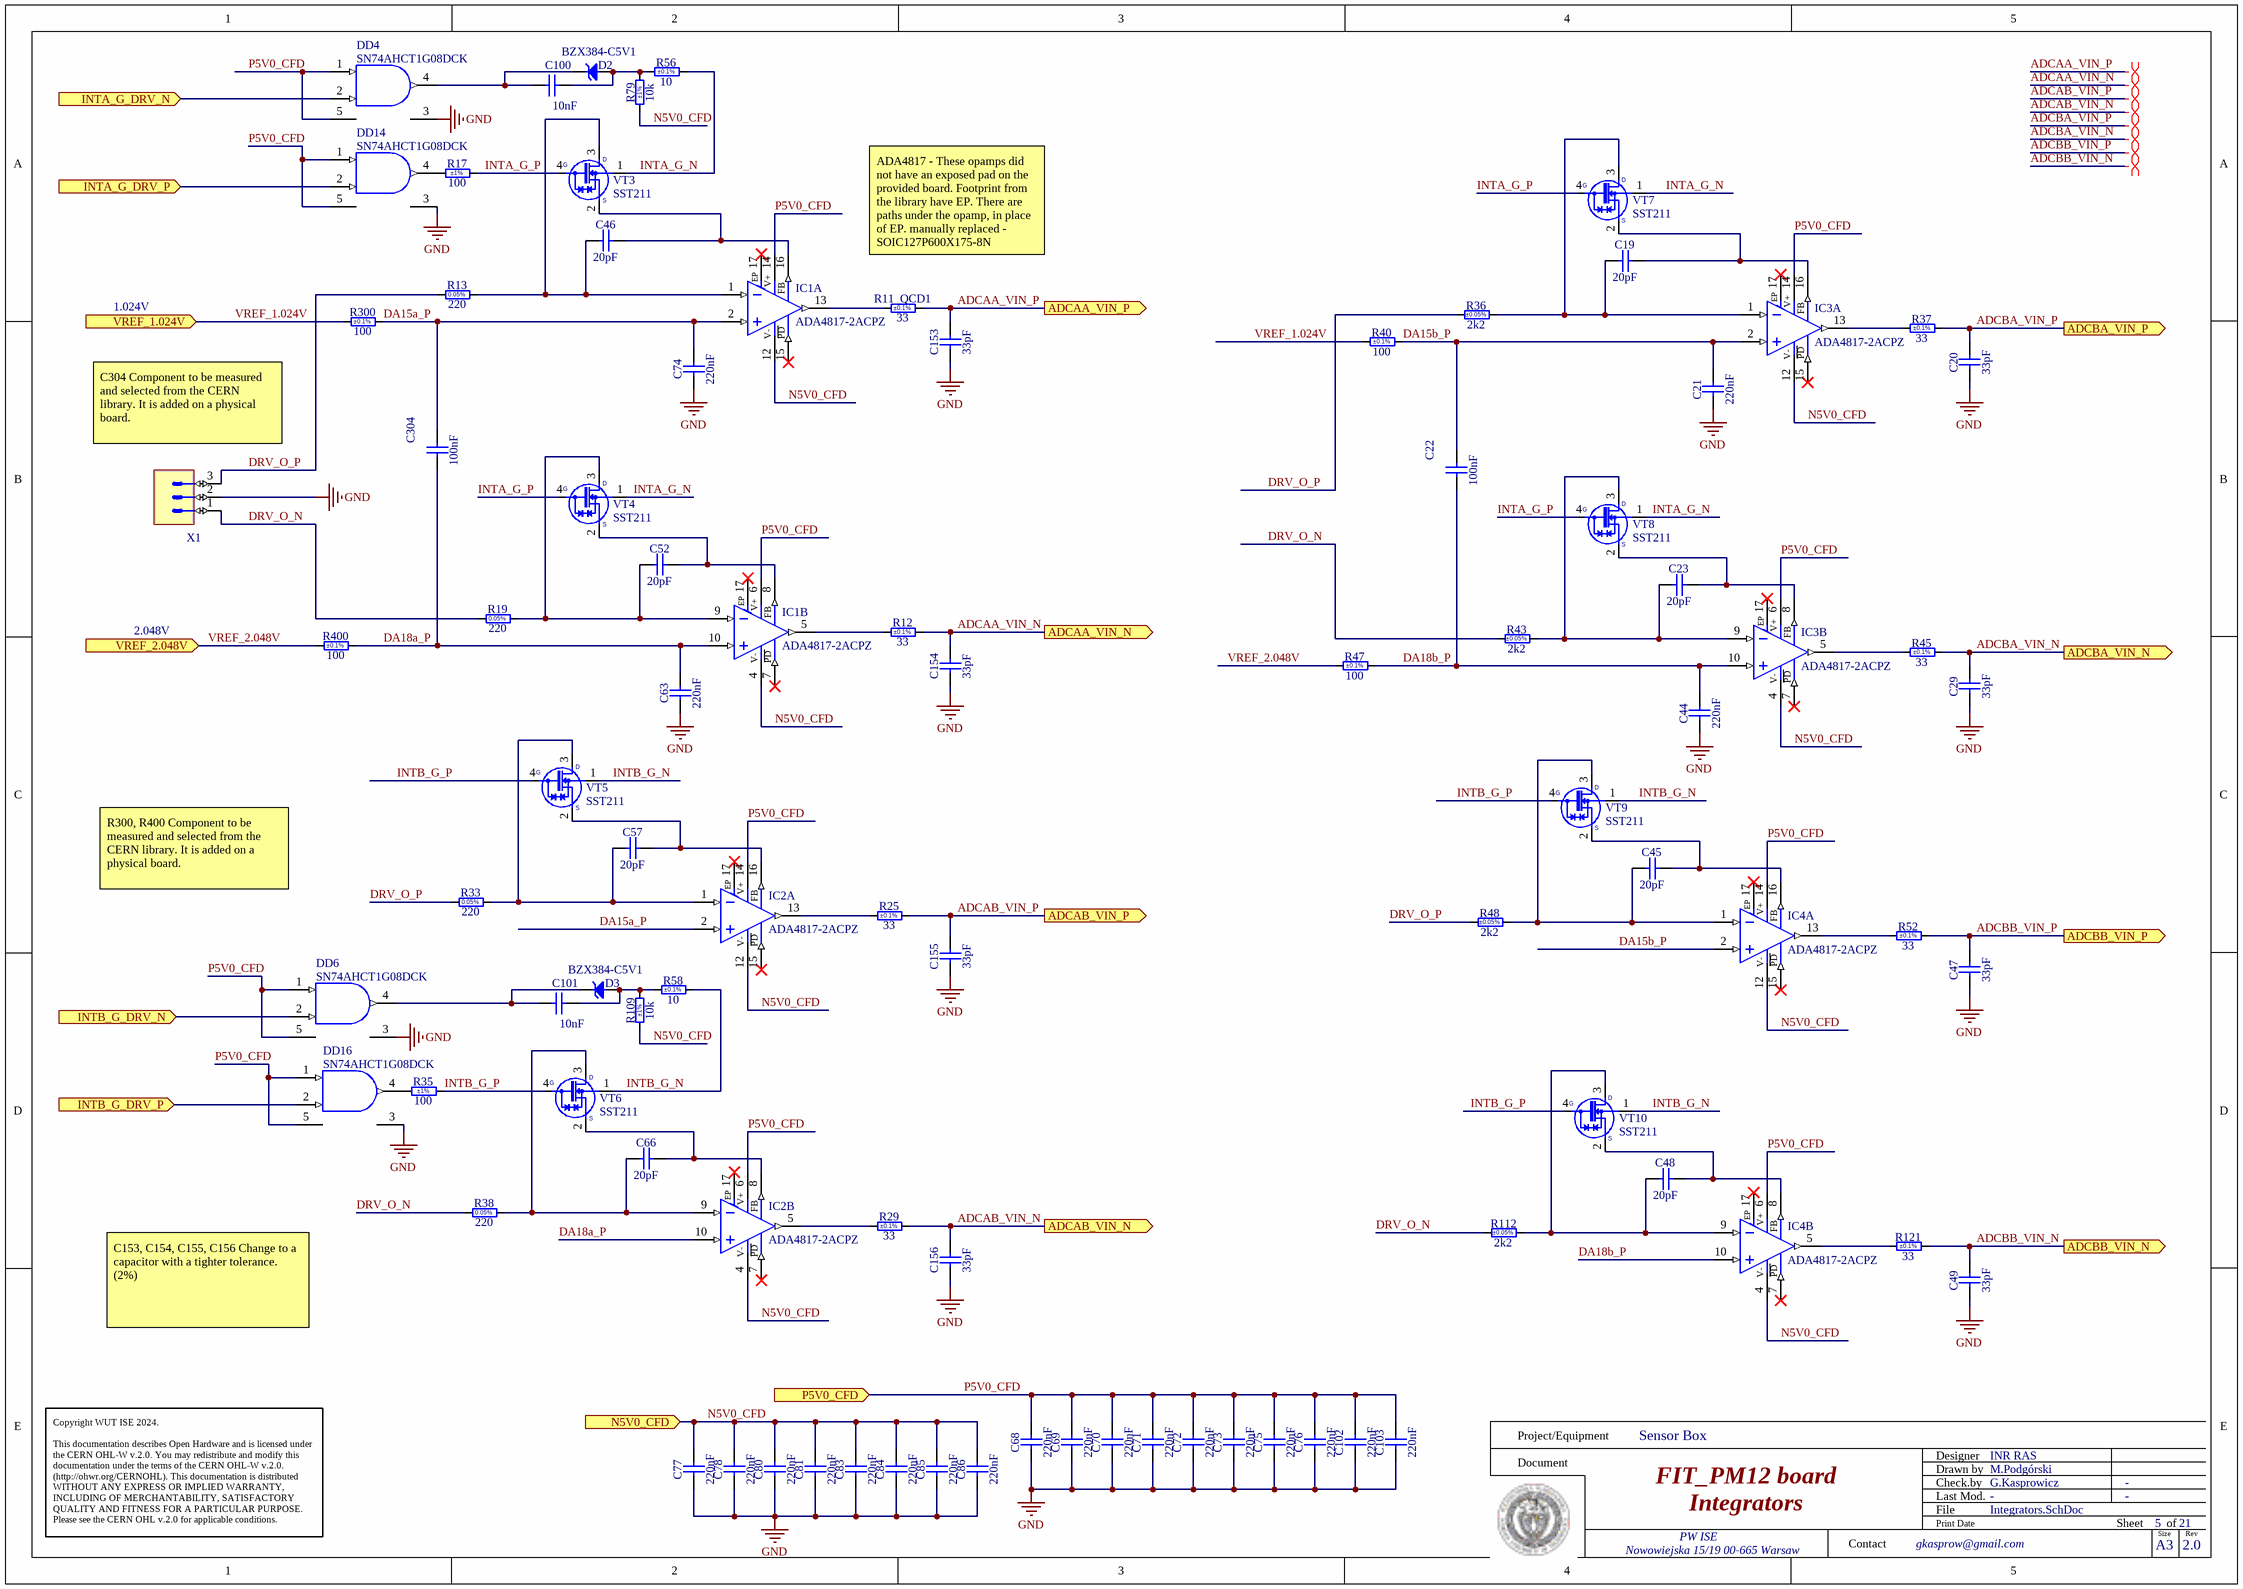
[diagram p13: Integrators.SchDoc]

### Parts
C19  20pF  [CAPC2012X135N]
C20  33pF  [CAPC1608X87N]
C21  220nF  [CAPC1005X55N]
C22  100nF  [CAPC2012X88N]
C23  20pF  [CAPC2012X135N]
C29  33pF  [CAPC1608X87N]
C44  220nF  [CAPC1005X55N]
C45  20pF  [CAPC2012X135N]
C46  20pF  [CAPC2012X135N]
C47  33pF  [CAPC1608X87N]
C48  20pF  [CAPC2012X135N]
C49  33pF  [CAPC1608X87N]
C52  20pF  [CAPC2012X135N]
C57  20pF  [CAPC2012X135N]
C63  220nF  [CAPC1005X55N]
C66  20pF  [CAPC2012X135N]
C68  220nF  [CAPC1005X55N]
C69  220nF  [CAPC1005X55N]
C70  220nF  [CAPC1005X55N]
C71  220nF  [CAPC1005X55N]
C72  220nF  [CAPC1005X55N]
C73  220nF  [CAPC1005X55N]
C74  220nF  [CAPC1005X55N]
C75  220nF  [CAPC1005X55N]
C76  220nF  [CAPC1005X55N]
C77  220nF  [CAPC1005X55N]
C78  220nF  [CAPC1005X55N]
C80  220nF  [CAPC1005X55N]
C81  220nF  [CAPC1005X55N]
C83  220nF  [CAPC1005X55N]
C84  220nF  [CAPC1005X55N]
C85  220nF  [CAPC1005X55N]
C86  220nF  [CAPC1005X55N]
C100  10nF  [CAPC1005X55N]
C101  10nF  [CAPC1005X55N]
C102  220nF  [CAPC1005X55N]
C103  220nF  [CAPC1005X55N]
C153  33pF  [CAPC1608X87N]
C154  33pF  [CAPC1608X87N]
C155  33pF  [CAPC1608X87N]
C156  33pF  [CAPC1608X87N]
C304  100nF  [CAPC2012X88N]
D2  BZX384-C5V1  [SOD2512X110N]
D3  BZX384-C5V1  [SOD2512X110N]
DD4  SN74AHCT1G08DCK  [SOT65P210X110-5N]
DD6  SN74AHCT1G08DCK  [SOT65P210X110-5N]
DD14  SN74AHCT1G08DCK  [SOT65P210X110-5N]
DD16  SN74AHCT1G08DCK  [SOT65P210X110-5N]
IC1  ADA4817-2ACPZ  [QFN65P400X400X80-17N-S240]  (parts A,B of 2)
IC2  ADA4817-2ACPZ  [QFN65P400X400X80-17N-S240]  (parts A,B of 2)
IC3  ADA4817-2ACPZ  [QFN65P400X400X80-17N-S240]  (parts A,B of 2)
IC4  ADA4817-2ACPZ  [QFN65P400X400X80-17N-S240]  (parts A,B of 2)
R11_QCD1  33  Tolerance: ±0.1%  [RESC1608X64N]
R12  33  Tolerance: ±0.1%  [RESC1608X64N]
R13  220  [RESC2012X60N]
R17  100  Tolerance: ±1%  [RESC1608X55N]
R19  220  [RESC2012X60N]
R25  33  Tolerance: ±0.1%  [RESC1608X64N]
R29  33  Tolerance: ±0.1%  [RESC1608X64N]
R33  220  [RESC2012X60N]
R35  100  Tolerance: ±1%  [RESC1608X55N]
R36  2k2  Tolerance: ±0.05%  [RESC2012X60N]
R37  33  Tolerance: ±0.1%  [RESC1608X64N]
R38  220  [RESC2012X60N]
R40  100  Tolerance: ±0.1%  [RES_VISHAY_FCHP0402]
R43  2k2  Tolerance: ±0.05%  [RESC2012X60N]
R45  33  Tolerance: ±0.1%  [RESC1608X64N]
R47  100  Tolerance: ±0.1%  [RES_VISHAY_FCHP0402]
R48  2k2  Tolerance: ±0.05%  [RESC2012X60N]
R52  33  Tolerance: ±0.1%  [RESC1608X64N]
R56  10  Tolerance: ±0.1%  [RESC2012X60N]
R58  10  Tolerance: ±0.1%  [RESC2012X60N]
R79  10k  Tolerance: ±1%  [RESC1608X55N]
R109  10k  Tolerance: ±1%  [RESC1608X55N]
R112  2k2  Tolerance: ±0.05%  [RESC2012X60N]
R121  33  Tolerance: ±0.1%  [RESC1608X64N]
R300  100  Tolerance: ±0.1%  [RES_VISHAY_FCHP0402]
R400  100  Tolerance: ±0.1%  [RES_VISHAY_FCHP0402]
VT3  SST211  [SOT143N]
VT4  SST211  [SOT143N]
VT5  SST211  [SOT143N]
VT6  SST211  [SOT143N]
VT7  SST211  [SOT143N]
VT8  SST211  [SOT143N]
VT9  SST211  [SOT143N]
VT10  SST211  [SOT143N]
X1  Header 3  [SAMTEC_DW-03-09-L-S-470]  (value not drawn)

### Ports
ADCAA_VIN_N (out), ADCAA_VIN_P (out), ADCAB_VIN_N (out), ADCAB_VIN_P (out), ADCBA_VIN_N (out), ADCBA_VIN_P (out), ADCBB_VIN_N (out), ADCBB_VIN_P (out), INTA_G_DRV_N (in), INTA_G_DRV_P (in), INTB_G_DRV_N (in), INTB_G_DRV_P (in), N5V0_CFD (in), P5V0_CFD (in), VREF_1.024V (in), VREF_2.048V (in)

### Nets
GND: C20.1 C21.1 C29.1 C44.1 C47.1 C49.1 C63.1 C68.1 C69.1 C70.1 C71.1 C72.1 C73.1 C74.1 C75.1 C76.1 C77.1 C78.1 C80.1 C81.1 C83.1 C84.1 C85.1 C86.1 C102.1 C103.1 C153.1 C154.1 C155.1 C156.1 DD4.3(GND) DD6.3(GND) DD14.3(GND) DD16.3(GND) X1.2
ADCAA_VIN_N: C154.2 R12.2 ; port ADCAA_VIN_N
ADCAA_VIN_P: C153.2 R11_QCD1.2 ; port ADCAA_VIN_P
ADCAB_VIN_N: C156.2 R29.2 ; port ADCAB_VIN_N
ADCAB_VIN_P: C155.2 R25.2 ; port ADCAB_VIN_P
ADCBA_VIN_N: C29.2 R45.2 ; port ADCBA_VIN_N
ADCBA_VIN_P: C20.2 R37.2 ; port ADCBA_VIN_P
ADCBB_VIN_N: C49.2 R121.2 ; port ADCBB_VIN_N
ADCBB_VIN_P: C47.2 R52.2 ; port ADCBB_VIN_P
DA15a_P: C74.2 C304.2 IC1.2(IN+) IC2.2(IN+) R300.1
DA15b_P: C21.2 C22.2 IC3.2(IN+) IC4.2(IN+) R40.1
DA18a_P: C63.2 C304.1 IC1.10(IN+) IC2.10(IN+) R400.1
DA18b_P: C22.1 C44.2 IC3.10(IN+) IC4.10(IN+) R47.1
DRV_O_N: R19.1 R38.1 R43.1 R112.1 X1.1
DRV_O_P: R13.1 R33.1 R36.1 R48.1 X1.3
INTA_G_DRV_N: DD4.2(A) ; port INTA_G_DRV_N
INTA_G_DRV_P: DD14.2(A) ; port INTA_G_DRV_P
INTA_G_N: R56.1 VT3.1(SUB) VT4.1(SUB) VT7.1(SUB) VT8.1(SUB)
INTA_G_P: R17.2 VT3.4(G) VT4.4(G) VT7.4(G) VT8.4(G)
INTB_G_DRV_N: DD6.2(A) ; port INTB_G_DRV_N
INTB_G_DRV_P: DD16.2(A) ; port INTB_G_DRV_P
INTB_G_N: R58.1 VT5.1(SUB) VT6.1(SUB) VT9.1(SUB) VT10.1(SUB)
INTB_G_P: R35.2 VT5.4(G) VT6.4(G) VT9.4(G) VT10.4(G)
N5V0_CFD: C77.2 C78.2 C80.2 C81.2 C83.2 C84.2 C85.2 C86.2 IC1.4(-Vs) IC1.12(-Vs) IC2.4(-Vs) IC2.12(-Vs) IC3.4(-Vs) IC3.12(-Vs) IC4.4(-Vs) IC4.12(-Vs) R79.1 R109.1 ; port N5V0_CFD
P5V0_CFD: C68.2 C69.2 C70.2 C71.2 C72.2 C73.2 C75.2 C76.2 C102.2 C103.2 DD4.1(B) DD4.5(VCC) DD6.1(B) DD6.5(VCC) DD14.1(B) DD14.5(VCC) DD16.1(B) DD16.5(VCC) IC1.6(+Vs) IC1.14(+Vs) IC2.6(+Vs) IC2.14(+Vs) IC3.6(+Vs) IC3.14(+Vs) IC4.6(+Vs) IC4.14(+Vs) ; port P5V0_CFD
VREF_1.024V: R40.2 R300.2 ; port VREF_1.024V
VREF_2.048V: R47.2 R400.2 ; port VREF_2.048V
NetC19_1: C19.1 IC3.1(IN-) R36.2 VT7.3(D)
NetC19_2: C19.2 IC3.16(FB) VT7.2(S)
NetC23_1: C23.1 IC3.9(IN-) R43.2 VT8.3(D)
NetC23_2: C23.2 IC3.8(FB) VT8.2(S)
NetC45_1: C45.1 IC4.1(IN-) R48.2 VT9.3(D)
NetC45_2: C45.2 IC4.16(FB) VT9.2(S)
NetC46_1: C46.1 IC1.1(IN-) R13.2 VT3.3(D)
NetC46_2: C46.2 IC1.16(FB) VT3.2(S)
NetC48_1: C48.1 IC4.9(IN-) R112.2 VT10.3(D)
NetC48_2: C48.2 IC4.8(FB) VT10.2(S)
NetC52_1: C52.1 IC1.9(IN-) R19.2 VT4.3(D)
NetC52_2: C52.2 IC1.8(FB) VT4.2(S)
NetC57_1: C57.1 IC2.1(IN-) R33.2 VT5.3(D)
NetC57_2: C57.2 IC2.16(FB) VT5.2(S)
NetC66_1: C66.1 IC2.9(IN-) R38.2 VT6.3(D)
NetC66_2: C66.2 IC2.8(FB) VT6.2(S)
NetC100_1: C100.1 D2.2(A) R56.2 R79.2
NetC100_2: C100.2 D2.1(C) DD4.4(Y)
NetC101_1: C101.1 D3.2(A) R58.2 R109.2
NetC101_2: C101.2 D3.1(C) DD6.4(Y)
NetDD14_4: DD14.4(Y) R17.1
NetDD16_4: DD16.4(Y) R35.1
NetIC1_5: IC1.5(OUT) R12.1
NetIC1_13: IC1.13(OUT) R11_QCD1.1
NetIC2_5: IC2.5(OUT) R29.1
NetIC2_13: IC2.13(OUT) R25.1
NetIC3_5: IC3.5(OUT) R45.1
NetIC3_13: IC3.13(OUT) R37.1
NetIC4_5: IC4.5(OUT) R121.1
NetIC4_13: IC4.13(OUT) R52.1

Not connected (* = marked no-connect by the designer): IC1 7(~{PD})* 15(~{PD})* 17(EP)*; IC2 7(~{PD})* 15(~{PD})* 17(EP)*; IC3 7(~{PD})* 15(~{PD})* 17(EP)*; IC4 7(~{PD})* 15(~{PD})* 17(EP)*

### Channels
U_AFE/INT1: designators C19=C19A C20=C20A C21=C21A C22=C22A C23=C23A C29=C29A C44=C44A C45=C45A C46=C46A C47=C47A C48=C48A C49=C49A C52=C52A C57=C57A C63=C63A C66=C66A C68=C68A C69=C69A C70=C70A C71=C71A C72=C72A C73=C73A C74=C74A C75=C75A C76=C76A C77=C77A C78=C78A#1 C80=C80A#1 C81=C81A#1 C83=C83A#1 C84=C84A#1 C85=C85A#1 C86=C86A C100=C100A C101=C101A C102=C102A C103=C103A C153=C153A C154=C154A C155=C155A C156=C156A C304=C304A D2=D2A D3=D3A DD4=DD4A DD6=DD6A DD14=DD14A DD16=DD16A IC1=IC1A IC2=IC2A IC3=IC3A IC4=IC4A R11_QCD1=R11_QCD1A R12=R12A R13=R13A R17=R17A R19=R19A R25=R25A R29=R29A R33=R33A R35=R35A R36=R36A R37=R37A R38=R38A R40=R40A R43=R43A R45=R45A R47=R47A R48=R48A R52=R52A R56=R56A R58=R58A R79=R79A R109=R109A R112=R112A R121=R121A R300=R300A R400=R400A VT3=VT3A VT4=VT4A VT5=VT5A VT6=VT6A VT7=VT7A VT8=VT8A VT9=VT9A VT10=VT10A X1=X1A; ports ADCAA_VIN_N=ADCAA_VIN_N ADCAA_VIN_P=ADCAA_VIN_P ADCAB_VIN_N=ADCAB_VIN_N ADCAB_VIN_P=ADCAB_VIN_P ADCBA_VIN_N=ADCBA_VIN_N ADCBA_VIN_P=ADCBA_VIN_P ADCBB_VIN_N=ADCBB_VIN_N ADCBB_VIN_P=ADCBB_VIN_P INTA_G_DRV_N=INTA_G_DRV_N1 INTA_G_DRV_P=INTA_G_DRV_P1 INTB_G_DRV_N=INTB_G_DRV_N1 INTB_G_DRV_P=INTB_G_DRV N5V0_CFD=N5V0_CFD P5V0_CFD=P5V0_CFD VREF_1.024V=VREF_1.024V VREF_2.048V=VREF_2.048V
U_AFE/INT2: designators C19=C19B C20=C20B C21=C21B C22=C22B C23=C23B C29=C29B C44=C44B C45=C45B C46=C46B C47=C47B C48=C48B C49=C49B C52=C52B C57=C57B C63=C63B C66=C66B C68=C68B C69=C69B C70=C70B C71=C71B C72=C72B C73=C73B C74=C74B C75=C75B C76=C76B C77=C77B C78=C78B#1 C80=C80B#1 C81=C81B#1 C83=C83B#1 C84=C84B#1 C85=C85B#1 C86=C86B C100=C100B C101=C101B C102=C102B C103=C103B C153=C153B C154=C154B C155=C155B C156=C156B C304=C304B D2=D2B D3=D3B DD4=DD4B DD6=DD6B DD14=DD14B DD16=DD16B IC1=IC1B IC2=IC2B IC3=IC3B IC4=IC4B R11_QCD1=R11_QCD1B R12=R12B R13=R13B R17=R17B R19=R19B R25=R25B R29=R29B R33=R33B R35=R35B R36=R36B R37=R37B R38=R38B R40=R40B R43=R43B R45=R45B R47=R47B R48=R48B R52=R52B R56=R56B R58=R58B R79=R79B R109=R109B R112=R112B R121=R121B R300=R300B R400=R400B VT3=VT3B VT4=VT4B VT5=VT5B VT6=VT6B VT7=VT7B VT8=VT8B VT9=VT9B VT10=VT10B X1=X1B; ports ADCAA_VIN_N=ADCAA_VIN_N ADCAA_VIN_P=ADCAA_VIN_P ADCAB_VIN_N=ADCAB_VIN_N ADCAB_VIN_P=ADCAB_VIN_P ADCBA_VIN_N=ADCBA_VIN_N ADCBA_VIN_P=ADCBA_VIN_P ADCBB_VIN_N=ADCBB_VIN_N ADCBB_VIN_P=ADCBB_VIN_P INTA_G_DRV_N=INTA_G_DRV_N2 INTA_G_DRV_P=INTA_G_DRV_P2 INTB_G_DRV_N=INTB_G_DRV_N2 INTB_G_DRV_P=INTB_G_DRV N5V0_CFD=N5V0_CFD P5V0_CFD=P5V0_CFD VREF_1.024V=VREF_1.024V VREF_2.048V=VREF_2.048V

### Layout directives
differential pair; differential pair class D100: ADCAA_VIN_N, ADCAA_VIN_P, ADCAB_VIN_N, ADCAB_VIN_P, ADCBA_VIN_N, ADCBA_VIN_P, ADCBB_VIN_N, ADCBB_VIN_P

### Notes on the sheet
- ADA4817 - These opamps did not have an exposed pad on the provided board. Footprint from the library have EP. There are paths under the opamp, in place of EP. manually replaced - SOIC127P600X175-8N
- 1.024V
- (near X1) C304 Component to be measured and selected from the CERN library. It is added on a physical board.
- 2.048V
- R300, R400 Component to be measured and selected from the CERN library. It is added on a physical board.
- C153, C154, C155, C156 Change to a capacitor with a tighter tolerance. (2%)
- Project/Equipment
- Document
- Designer
- Drawn by
- Check.by
- Copyright WUT ISE 2024.
  This documentation describes Open Hardware and is licensed under the CERN OHL-W v.2.0. You may redistribute and modify this documentation under the terms of the CERN OHL-W v.2.0. (http://ohwr.org/CERNOHL). This documentation is distributed WITHOUT ANY EXPRESS OR IMPLIED WARRANTY, INCLUDING OF MERCHANTABILITY, SATISFACTORY QUALITY AND FITNESS FOR A PARTICULAR PURPOSE. Please see the CERN OHL v.2.0 for applicable conditions.
- Contact
- File
- Last Mod.
- Print Date
- Sheet
- Size
- A3
- of
- Rev
- (in symbol ADA4817-2ACPZ, part A) V+; V-; PD
- (in symbol ADA4817-2ACPZ, part B) V+; V-; PD
- (in symbol R0805_220R_0.05%_0.125W_10PPM) 0.05%

### Library data of the parts
C19 C23 C45 C46 C48 C52 C57 C66 = CC0805_20PF_50V_2%_C0G: Non-polarised capacitor; Part Description: SMD Multilayer Chip Ceramic Capacitor; Manufacturer: GENERIC; Manufacturer1 Part Number: CC0805GRNPO9BN200; Voltage: 50V; TC: C0G/NP0; Tolerance: ±2%; Part Number: CC0805_20PF_50V_2%_C0G; Component Kind: Standard; Component Type: Standard; Pin Count: 2; Value: 20pF; Status: None; Manufacturer Part Number: CC0805_20PF_50V_2%_C0G; Case: 0805; Mounted: Yes; Socket: No; SMD: Yes; Sense: No; Manufacturer1 Example: YAGEO PHYCOMP; Manufacturer1 ComponentHeight: 1.45mm; HelpURL: \\cern.ch\dfs\Applications\Altium\Datasheets\CC0805_NP0_YAGEO.pdf; Author: CERN DEM HF; CreateDate: 07.05.2024; LatestRevisionDate: 07.05.2024
C20 C29 C47 C49 C153-C156 = CC0603_33PF_50V_5%_NP0: Non-polarised capacitor; Part Description: SMD Multilayer Chip Ceramic Capacitor; Manufacturer: GENERIC; Manufacturer1 Part Number: 223886715339; Voltage: 50V; TC: C0G/NP0; Tolerance: ±5%; Part Number: CC0603_33PF_50V_5%_NP0; Component Kind: Standard; Component Type: Standard; Pin Count: 2; Value: 33pF; Status: Preferred; Manufacturer Part Number: CC0603_33PF_50V_5%_NP0; Case: 0603; Mounted: Yes; Socket: No; SMD: Yes; Sense: No; Manufacturer1 Example: PHYCOMP; Manufacturer1 ComponentHeight: 0.87mm; HelpURL: \\cern.ch\dfs\Applications\Altium\Datasheets\CC0603_NP0_PHYCOMP.pdf; Author: CERN DEM JLC; CreateDate: 03.12.2007; LatestRevisionDate: 03.12.2007
C21 C44 C63 C68-C78 C80 C81 C83-C86 C102 C103 = CC0402_220NF_16V_10%_X7R: Non-polarised capacitor; Part Description: SMD Multilayer Chip Ceramic Capacitor; Manufacturer: GENERIC; Manufacturer1 Part Number: C1005X7R1C224K050; Voltage: 16V; TC: X7R; Tolerance: ±10%; Part Number: CC0402_220NF_16V_10%_X7R; Component Kind: Standard; Component Type: Standard; Pin Count: 2; Value: 220nF; Status: Preferred; Manufacturer Part Number: CC0402_220NF_16V_10%_X7R; Case: 0402; Mounted: Yes; Socket: No; SMD: Yes; Sense: No; Manufacturer1 Example: TDK; Manufacturer1 ComponentHeight: 0.55mm; HelpURL: \\cern.ch\dfs\Applications\Altium\Datasheets\CC0402_X7R_TDK_C.pdf; Author: CERN DEM JLC; CreateDate: 25.10.2012; LatestRevisionDate: 25.10.2012
C22 C304 = CC0805_100NF_50V_1%_NP0: Non-polarised capacitor; Part Description: SMD Multilayer Chip Ceramic Capacitor; Manufacturer: GENERIC; Manufacturer1 Part Number: 0805N103F500C; Voltage: 50V; TC: C0G/NP0; Tolerance: ±1%; Part Number: CC0805_100NF_50V_1%_NP0; Component Kind: Standard; Component Type: Standard; Footprint: CAPC2012X135N; Pin Count: 2; Value: 100nF; Status: Not Recommended; Manufacturer Part Number: CC0805_100NF_50V_1%_NP0; Case: 0805; Mounted: Yes; Socket: No; SMD: Yes; Sense: No; ComponentHeight: 1.35mm; Manufacturer1 Example: WALSIN TECHNOLOGY CORPORATION; Manufacturer1 ComponentHeight: 1.35mm; HelpURL: \\cern.ch\dfs\Applications\Altium\Datasheets\CC0805_WALSIN_0805.pdf; Author: CERN DEM HF; CreateDate: 28.08.2023; LatestRevisionDate: 28.08.2023
C100 C101 = CC0402_10NF_25V_10%_X7R: Non-polarised capacitor; Part Description: SMD Multilayer Chip Ceramic Capacitor; Manufacturer: GENERIC; Manufacturer1 Part Number: C1005X7R1E103K050; Voltage: 25V; TC: X7R; Tolerance: ±10%; Part Number: CC0402_10NF_25V_10%_X7R; Component Kind: Standard; Component Type: Standard; Pin Count: 2; Value: 10nF; Status: Preferred; Manufacturer Part Number: CC0402_10NF_25V_10%_X7R; Case: 0402; Mounted: Yes; Socket: No; SMD: Yes; Sense: No; Manufacturer1 Example: TDK; Manufacturer1 ComponentHeight: 0.55mm; HelpURL: \\cern.ch\dfs\Applications\Altium\Datasheets\CC0402_X7R_TDK_C.pdf; Author: CERN DEM JLC; CreateDate: 25.10.2012; LatestRevisionDate: 25.10.2012
D2 D3 = BZX384-C5V1: Zener Diode; Part Description: Zener Voltage Regulator; Manufacturer: NEXPERIA; Voltage: 5.1V; Power: 300mW; PressFit: No; Bonding: No; Part Number: BZX384-C5V1; Component Kind: Standard; Component Type: Standard; Device: BZX384-C5V1; PackageDescription: Small Outline Diode (SOD-323), 1.70mm W X 1.25mm L X 1.10mm H body,  IPC Medium Density; Manufacturer Part Number: BZX384-C5V1; Pin Count: 2; Case: SOD-323; Mounted: Yes; Socket: No; SMD: Yes; Sense: No; ComponentHeight: 1.1mm; HelpURL: \\cern.ch\dfs\Applications\Altium\Datasheets\BZX384.pdf; Author: CERN DEM MR; CreateDate: 24.07.2018; LatestRevisionDate: 24.07.2018
DD4 DD6 DD14 DD16 = SN74AHCT1G08DCK: Single 2-Input AND Gate; Part Description: Single 2-Input Positive-AND Gate; Manufacturer: TEXAS INSTRUMENTS; PressFit: No; Bonding: No; Part Number: SN74AHCT1G08DCK; Component Kind: Standard; Component Type: Standard; Device: SN74AHCT1G08DCK; PackageDescription: SOT353, SC70-5, 0.65mm Pitch; 5 Pin, 1.25mm W X 2.00mm L X 1.10mm H body, IPC Medium Density; Manufacturer Part Number: SN74AHCT1G08DCK; Pin Count: 5; Case: SOT353; Mounted: Yes; Socket: No; SMD: Yes; Sense: No; ComponentHeight: 1.1mm; Author: CERN DEM HF; HelpURL: \\cern.ch\dfs\Applications\Altium\Datasheets\NC7SZ08.pdf; CreateDate: 17.05.2024; LatestRevisionDate: 17.05.2024
IC1-IC4 = ADA4817-2ACPZ: Dual Low Noise, 1GHz FastFEET Operational Amplifier; Manufacturer: ANALOG DEVICES; PressFit: No; Bonding: No; Part Number: ADA4817-2ACPZ; Component Kind: Standard; Component Type: Standard; Device: ADA4817-2ACPZ; PackageDescription: QFN, 0.65mm Pitch, Square; 16 Pin, 4.00mm L X 4.00mm W X 0.80mm H body (w/Thermal Tab 2.40 X 2.40mm), IPC Medium Density; Part Description: Dual Low Noise, 1GHz FastFEET Operational Amplifier; Manufacturer Part Number: ADA4817-2ACP; Pin Count: 17; Case: QFN16; Mounted: Yes; Socket: No; SMD: Yes; Sense: No; ComponentHeight: 0.8mm; Author: CERN DEM BC; HelpURL: \\cern.ch\dfs\Applications\Altium\Datasheets\ADA4817-2ACPZ.pdf; CreateDate: 25.03.2020; LatestRevisionDate: 31.03.2022
R11_QCD1 R12 R25 R29 R37 R45 R52 R121 = R0603_33R_0.1%_0.1W_10PPM: Resistor - 0.1%; Part Description: Thin Film Chip Resistor; Manufacturer: GENERIC; Manufacturer1 Part Number: RT0603BRD0733RL; Power: 0.1W; TC: ±10ppm/°C; PressFit: No; Part Number: R0603_33R_0.1%_0.1W_10PPM; Component Kind: Standard; Component Type: Standard; Pin Count: 2; Value: 33; Status: Not Recommended; Manufacturer Part Number: R0603_33R_0.1%_0.1W_10PPM; Case: 0603; Mounted: Yes; Sense: No; Socket: No; SMD: Yes; Manufacturer1 Example: YAGEO; Manufacturer1 ComponentHeight: 0.55mm; HelpURL: \\cern.ch\dfs\Applications\Altium\Datasheets\R0603_YAGEO_RT.pdf; Author: CERN DEM HF; CreateDate: 17.05.2024; LatestRevisionDate: 17.05.2024
R13 R19 R33 R38 = R0805_220R_0.05%_0.125W_10PPM: Resistor - 0.05%; Part Description: Thin Film Chip Resistor; Manufacturer: GENERIC; Manufacturer1 Part Number: RG2012N-221-W-T1; Power: 0.125W; TC: ±10ppm/°C; PressFit: No; Part Number: R0805_220R_0.05%_0.125W_10PPM; Component Kind: Standard; Component Type: Standard; Pin Count: 2; Value: 220; Status: Not Recommended; Tolerance: ±0.05%; Manufacturer Part Number: R0805_220R_0.05%_0.125W_10PPM; Case: 0805; Mounted: Yes; Sense: No; Socket: No; SMD: Yes; Manufacturer1 Example: SUSUMU; Manufacturer1 ComponentHeight: 0.5mm; HelpURL: \\cern.ch\dfs\Applications\Altium\Datasheets\R0805_SUSUMU_RG.pdf; Author: CERN DEM HF; CreateDate: 17.05.2024; LatestRevisionDate: 17.05.2024
R17 R35 = R0603_100R_1%_0.1W_100PPM: Resistor - 1%; Part Description: General Purpose Thick Film Chip Resistor; Manufacturer: GENERIC; Manufacturer1 Part Number: NRC06F4700TRF; Power: 0.1W; TC: ±100ppm/°C; PressFit: No; Part Number: R0603_100R_1%_0.1W_100PPM; Component Kind: Standard; Component Type: Standard; Pin Count: 2; Value: 100; Status: Preferred; Manufacturer Part Number: R0603_100R_1%_0.1W_100PPM; Case: 0603; Mounted: Yes; Sense: No; Socket: No; SMD: Yes; Manufacturer1 Example: NIC COMPONENT; Manufacturer1 ComponentHeight: 0.55mm; HelpURL: \\cern.ch\dfs\Applications\Altium\Datasheets\R0603_NIC_NRC.pdf; Author: CERN DEM JLC; CreateDate: 03.12.2007; LatestRevisionDate: 13.03.2008
R36 R43 R48 R112 = R0805_2K2_1%_0.125W_100PPM: Resistor - 0.05%; Part Number: R0805_2K2_0.05%_0.125W_100PPM; Part Description: General Purpose Thick Film Chip Resistor; Manufacturer: GENERIC; Manufacturer1 Part Number: ERA-6ARW222V; Power: 0.125W; TC: ±100ppm/°C; PressFit: No; Component Kind: Standard; Component Type: Standard; Pin Count: 2; Value: 2k2; Status: Preferred; Manufacturer Part Number: R0805_2K2_0.05%_0.125W_100PPM; Case: 0805; Mounted: Yes; Sense: No; Socket: No; SMD: Yes; Manufacturer1 Example: Panasonic; Manufacturer1 ComponentHeight: 0.6mm; HelpURL: \\cern.ch\dfs\Applications\Altium\Datasheets\R0805_NIC_NRC.pdf; Author: CERN DEM JLC; CreateDate: 03.12.2007; LatestRevisionDate: 13.03.2008
R40 R47 R300 R400 = R0402_100R_0.1%_1W_25PPM_VISHAY_FCHP0402E1000BS: Resistor - 0.1%; Part Description: High Frequency 60 GHz High Power 1 W Thin Film Surface Mount Chip Resistor; Manufacturer: VISHAY; Power: 1W; TC: ±25ppm/°C; PressFit: No; Part Number: R0402_100R_0.1%_1W_25PPM_VISHAY_FCHP0402E1000BS; Component Kind: Standard; Component Type: Standard; Pin Count: 2; Value: 100; Status: Not Recommended; Manufacturer Part Number: FCHP0402E1000BS; Case: 0402; Mounted: Yes; Sense: No; Socket: No; SMD: Yes; ComponentHeight: 0.38mm; HelpURL: \\cern.ch\dfs\Applications\Altium\Datasheets\R0402_VISHAY_FCHP.pdf; Author: CERN DEM HF; CreateDate: 04.04.2023; LatestRevisionDate: 04.04.2023
R56 R58 = R0805_10R_0.1%_0.1W_10PPM: Resistor - 0.1%; Part Description: Thin Film Chip Resistor; Manufacturer: GENERIC; Manufacturer1 Part Number: RN73C2A10RBTG; Power: 0.1W; TC: ±10ppm; PressFit: No; Part Number: R0805_10R_0.1%_0.1W_10PPM; Component Kind: Standard; Component Type: Standard; Pin Count: 2; Value: 10; Status: Not Recommended; Manufacturer Part Number: R0805_10R_0.1%_0.1W_10PPM; Case: 0805; Mounted: Yes; Sense: No; Socket: No; SMD: Yes; Manufacturer1 Example: TYCO HOLSWORTHY; Manufacturer1 ComponentHeight: 0.6mm; HelpURL: \\cern.ch\dfs\Applications\Altium\Datasheets\R0805_Tyco_RN73.pdf; Author: CERN DEM JLC; CreateDate: 03.12.2007; LatestRevisionDate: 13.03.2008
R79 R109 = R0603_10K_1%_0.1W_100PPM: Resistor - 1%; Part Description: General Purpose Thick Film Chip Resistor; Manufacturer: GENERIC; Manufacturer1 Part Number: NRC06F1002TRF; Power: 0.1W; TC: ±100ppm/°C; PressFit: No; Part Number: R0603_10K_1%_0.1W_100PPM; Component Kind: Standard; Component Type: Standard; Pin Count: 2; Value: 10k; Status: Preferred; Manufacturer Part Number: R0603_10K_1%_0.1W_100PPM; Case: 0603; Mounted: Yes; Sense: No; Socket: No; SMD: Yes; Manufacturer1 Example: NIC COMPONENT; Manufacturer1 ComponentHeight: 0.55mm; HelpURL: \\cern.ch\dfs\Applications\Altium\Datasheets\R0603_NIC_NRC.pdf; Author: CERN DEM JLC; CreateDate: 03.12.2007; LatestRevisionDate: 13.03.2008
VT3-VT10 = SST211: 30V, 50 mA N-Channel Enhancement Switching Transistor; Part Description: 30V, 50mA, N-Channel Enhancement Switching Transistor; Manufacturer: Linear Systems; PressFit: No; Bonding: No; Part Number: SST211; Component Kind: Standard; Component Type: Standard; Device: SST211; PackageDescription: SOT143, 4-Leads, Body 3.0x2.6mm (max), Pitch 1.92mm, IPC Medium Density; Status: Obsolete; Manufacturer Part Number: SST211; Pin Count: 4; Case: SOT143; Mounted: Yes; Socket: No; SMD: Yes; Sense: No; ComponentHeight: 1.3mm; HelpURL: \\cern.ch\dfs\Applications\Altium\Datasheets\BSS83,215.pdf; Author: CERN DEM JLC; CreateDate: 01.07.2014; LatestRevisionDate: 17.05.2016
X1 = SAMTEC_DW-03-09-L-S-470: Connector 3 Male; Part Description: 3 Contacts, Pitch 2.54mm, Single Row Straight .Flex Stack, Flexible Board Stacker (Stacker Height = 11,938mm); Manufacturer: SAMTEC; PressFit: No; Part Number: SAMTEC_DW-03-09-L-S-470; Component Kind: Standard; Component Type: Standard; Pin Count: 3; Family: Header 3; Mounted: Yes; Socket: No; SMD: No; Sense: No; Status: None; Manufacturer Part Number: DW-03-09-L-S-470; ComponentHeight: 15.75mm; HelpURL: \\cern.ch\dfs\Applications\Altium\Datasheets\SAMTEC_DW.pdf; Author: CERN DEM HF; CreateDate: 06.06.2024; LatestRevisionDate: 06.06.2024

## Sheet DAC8554.SchDoc: FIT_PM12 board
size 420 x 297 mm; CheckedBy: G.Kasprowicz; Author: INR Moscow; CompanyName: WUT ISE; DrawnBy: M.Podgórski; Organization: WUT ISE; Address1: PW ISE; Address2: Nowowiejska 15/19 00-665 Warsaw; Address3: gkasprow@gmail.com; DocumentNumber: 8; Revision: 2; SheetNumber: 8; SheetTotal: 21; ModifiedBy: -; CheckedDate: -; Title2: DACs; DivGrp: WUT ISE; Designer: INR RAS; ModifiedDate: -; ProjectName: Sensor Box
Used 2 times, as channels U_AFE/QDC1, U_AFE/QDC2. Parts and nets are listed once, with the designators drawn on the sheet.
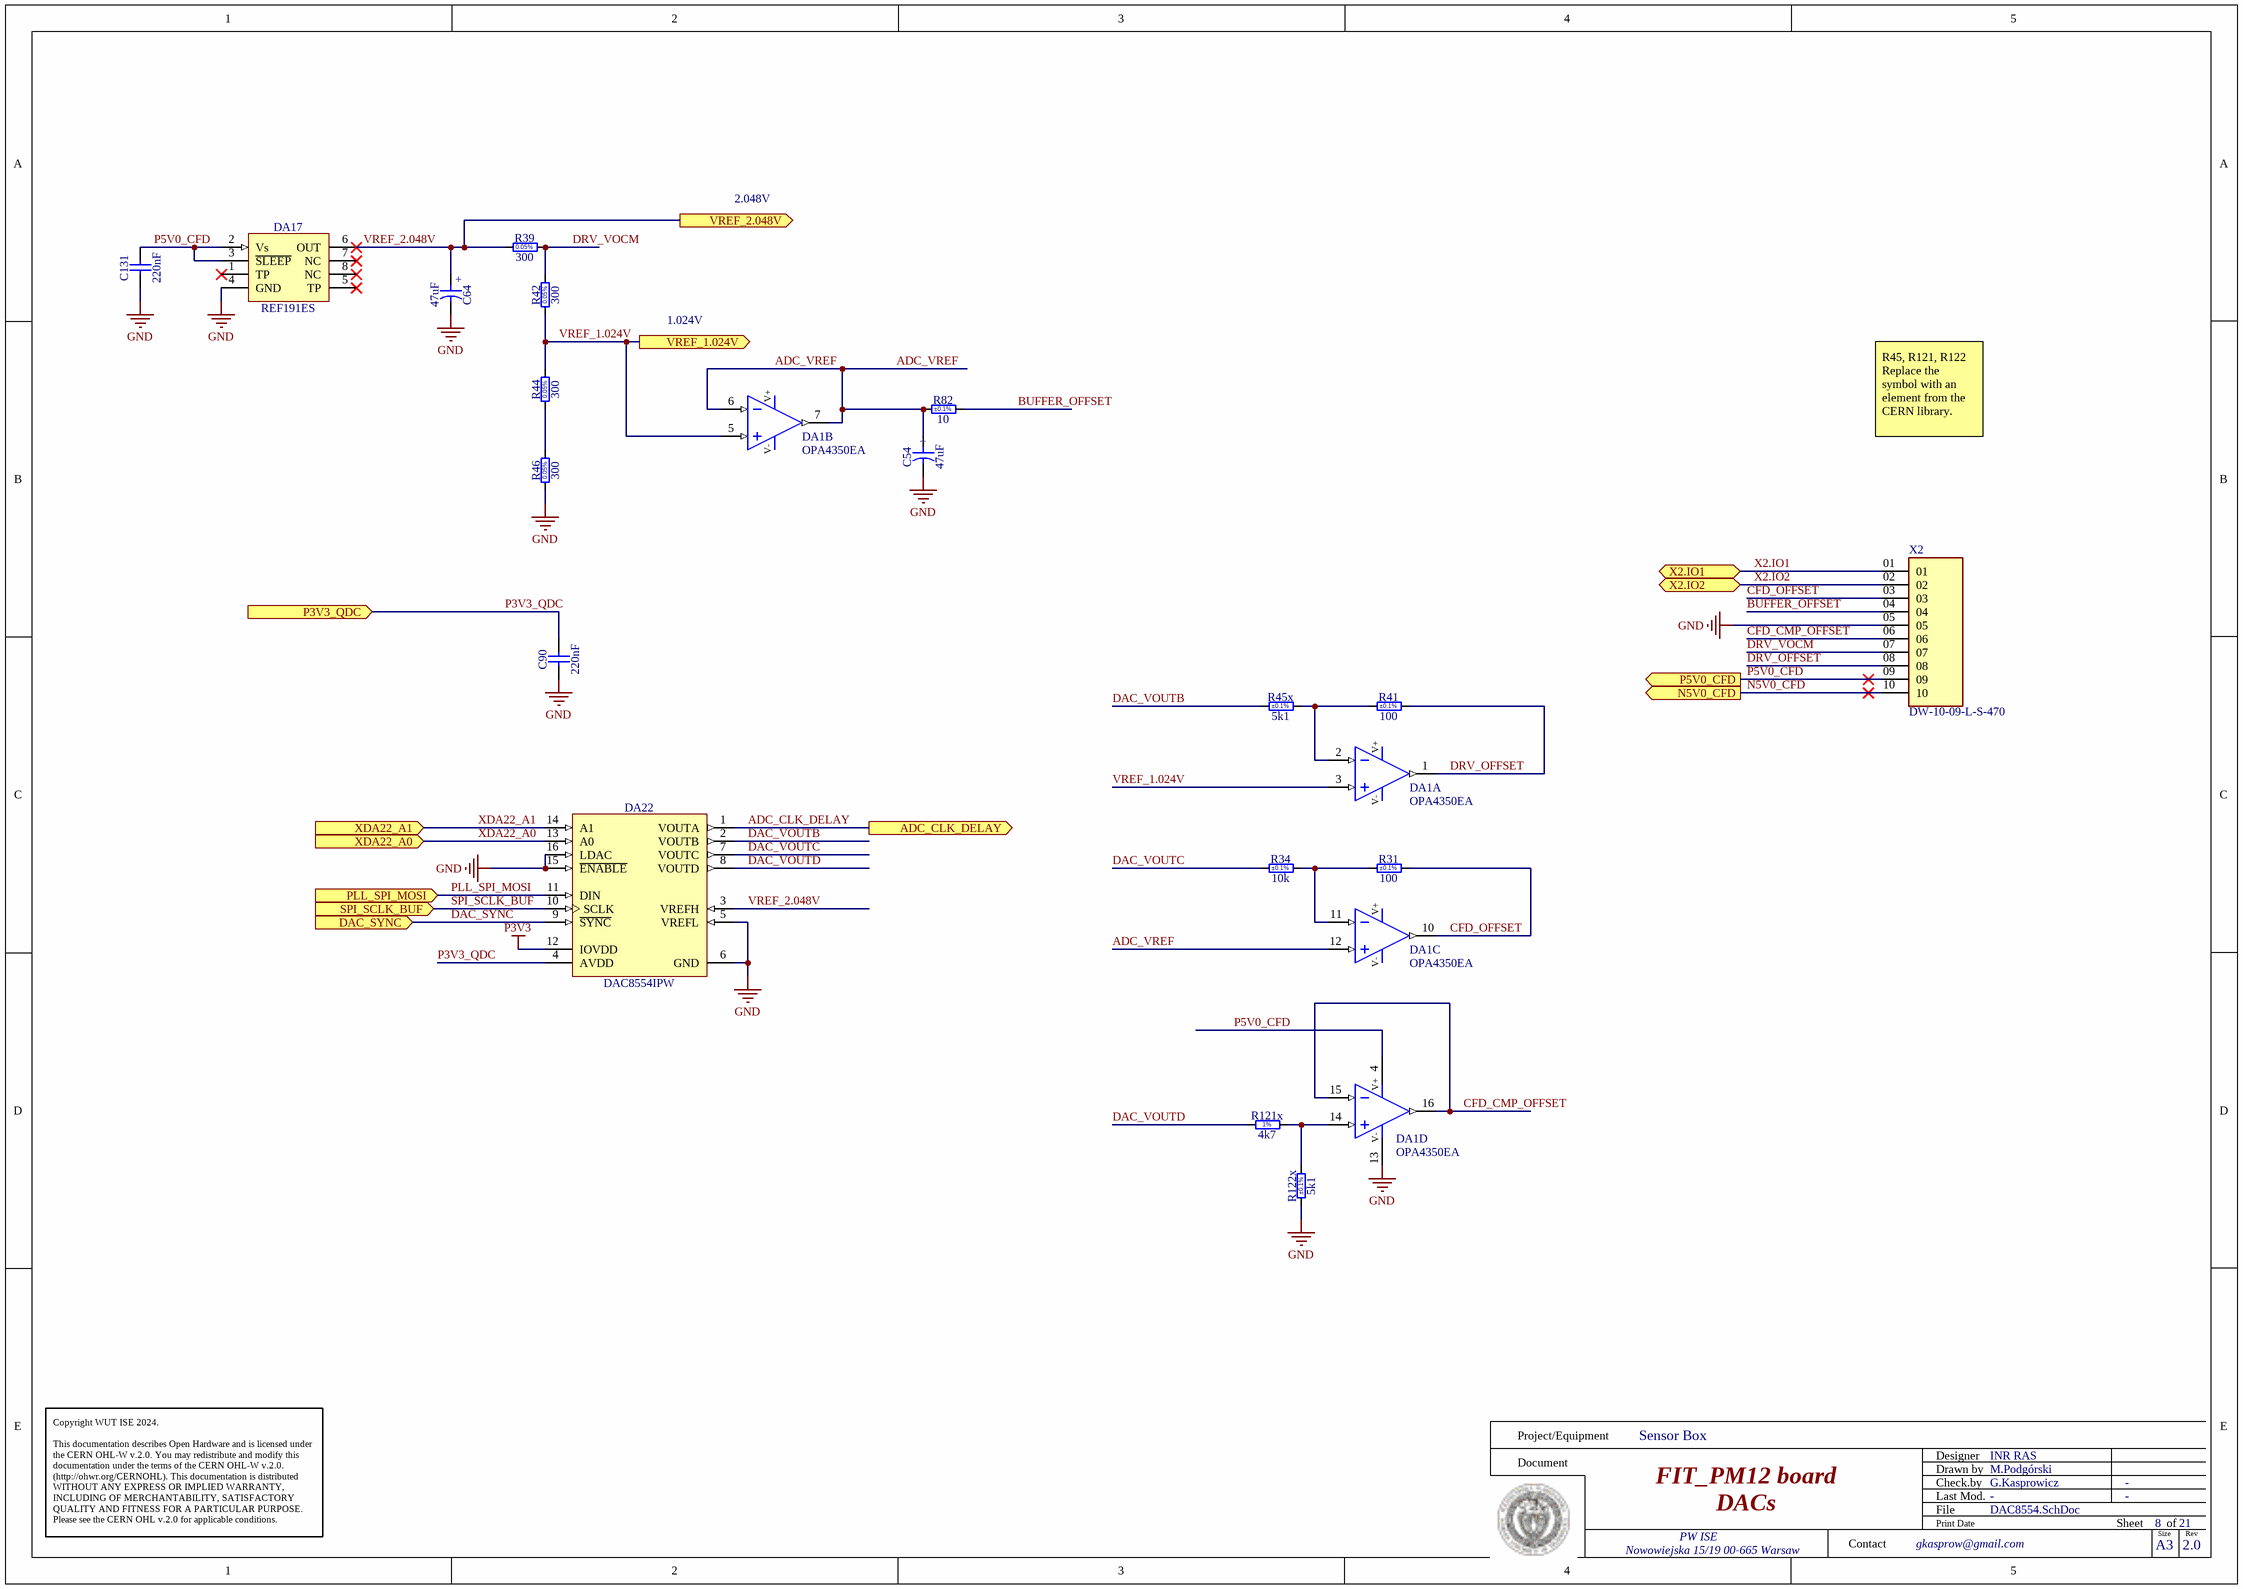
[diagram p14: DAC8554.SchDoc]

### Parts
C54  47uF  [CAPMP3528X120N]
C64  47uF  [CAPMP3528X120N]
C90  220nF  [CAPC1005X55N]
C131  220nF  [CAPC2012X135N]
DA1  OPA4350EA  [SOP63P600X175-16N]  (parts A,B,C,D of 4)
DA17  REF191ES  [SOIC127P600X175-8N]
DA22  DAC8554IPW  [SOP65P640X110-16N]
R31  100  Tolerance: ±0.1%  [RES_VISHAY_FCHP0402]
R34  10k  Tolerance: ±0.1%  [RESC2012X60N]
R39  300  [RESC2012X60N]
R41  100  Tolerance: ±0.1%  [RES_VISHAY_FCHP0402]
R42  300  [RESC2012X60N]
R44  300  [RESC2012X60N]
R45x  5k1  Tolerance: ±0.1%  [RESC2012X60N]
R46  300  [RESC2012X60N]
R82  10  Tolerance: ±0.1%  [RESC2012X60N]
R121x  4k7  [RESC1005X40N]
R122x  5k1  Tolerance: ±0.1%  [RESC2012X60N]
X2  DW-10-09-L-S-470  [SAMTEC_DW-10-X-X-S-X]

### Ports
ADC_CLK_DELAY (out), DAC_SYNC (in), N5V0_CFD (out), P3V3_QDC (in), P5V0_CFD (out), PLL_SPI_MOSI (in), SPI_SCLK_BUF (in), VREF_1.024V (out), VREF_2.048V (out), X2.IO1 (bidir), X2.IO2 (bidir), XDA22_A0 (in), XDA22_A1 (in)

### Nets
GND: C54.2 C64.2 C90.1 C131.1 DA1.13(V-) DA17.4(GND) DA22.5(VREFL) DA22.6(GND) DA22.15(~{ENABLE}) DA22.16(LDAC) R46.1 R122x.1 X2.05
P3V3: DA22.12(IOVDD)
ADC_CLK_DELAY: DA22.1(VOUTA) ; port ADC_CLK_DELAY
ADC_VREF: C54.1 DA1.6(IN-) DA1.7(OUT) DA1.12(IN+) R82.2
BUFFER_OFFSET: R82.1 X2.04
CFD_CMP_OFFSET: DA1.15(IN-) DA1.16(OUT) X2.06
CFD_OFFSET: DA1.10(OUT) R31.1 X2.03
DAC_SYNC: DA22.9(~{SYNC}) ; port DAC_SYNC
DAC_VOUTB: DA22.2(VOUTB) R45x.1
DAC_VOUTC: DA22.7(VOUTC) R34.1
DAC_VOUTD: DA22.8(VOUTD) R121x.1
DRV_OFFSET: DA1.1(OUT) R41.1 X2.08
DRV_VOCM: R39.2 R42.2 X2.07
N5V0_CFD: X2.10 ; port N5V0_CFD
P3V3_QDC: C90.2 DA22.4(AVDD) ; port P3V3_QDC
P5V0_CFD: C131.2 DA1.4(V+) DA17.2(Vs) DA17.3(~{SLEEP}) X2.09 ; port P5V0_CFD
PLL_SPI_MOSI: DA22.11(DIN) ; port PLL_SPI_MOSI
SPI_SCLK_BUF: DA22.10(SCLK) ; port SPI_SCLK_BUF
VREF_1.024V: DA1.3(IN+) DA1.5(IN+) R42.1 R44.2 ; port VREF_1.024V
VREF_2.048V: C64.1 DA17.6(OUT) DA22.3(VREFH) R39.1 ; port VREF_2.048V
X2.IO1: X2.01 ; port X2.IO1
X2.IO2: X2.02 ; port X2.IO2
XDA22_A0: DA22.13(A0) ; port XDA22_A0
XDA22_A1: DA22.14(A1) ; port XDA22_A1
NetDA1_2: DA1.2(IN-) R41.2 R45x.2
NetDA1_11: DA1.11(IN-) R31.2 R34.2
NetDA1_14: DA1.14(IN+) R121x.2 R122x.2
NetR44_1: R44.1 R46.2

Not connected (* = marked no-connect by the designer): DA17 1(TP)* 5(TP)* 7(NC)* 8(NC)*

### Channels
U_AFE/QDC1: designators end in A; ports ADC_CLK_DELAY=ADC_CLK_DELAY DAC_SYNC=DAC_SYNC N5V0_CFD=N5V0_CFD P3V3_QDC=P3V3_QDC P5V0_CFD=P5V0_CFD PLL_SPI_MOSI=PLL_SPI_MOSI SPI_SCLK_BUF=SPI_SCLK_BUF VREF_1.024V=VREF_1.024V VREF_2.048V=VREF_2.048V X2.IO1=X2.IO1_QDC1 X2.IO2=X2.IO2_QDC1 XDA22_A0=GND XDA22_A1=GND
U_AFE/QDC2: designators end in B; ports ADC_CLK_DELAY=ADC_CLK_DELAY DAC_SYNC=DAC_SYNC N5V0_CFD=N5V0_CFD P3V3_QDC=P3V3_QDC P5V0_CFD=P5V0_CFD PLL_SPI_MOSI=PLL_SPI_MOSI SPI_SCLK_BUF=SPI_SCLK_BUF VREF_1.024V=VREF_1.024V VREF_2.048V=VREF_2.048V X2.IO1=X2.IO1_QDC2 X2.IO2=X2.IO2_QDC2 XDA22_A0=GND XDA22_A1=P3V3

### Notes on the sheet
- 2.048V
- 1.024V
- R45, R121, R122 Replace the symbol with an element from the CERN library.
- Project/Equipment
- Document
- Designer
- Drawn by
- Check.by
- Copyright WUT ISE 2024.
  This documentation describes Open Hardware and is licensed under the CERN OHL-W v.2.0. You may redistribute and modify this documentation under the terms of the CERN OHL-W v.2.0. (http://ohwr.org/CERNOHL). This documentation is distributed WITHOUT ANY EXPRESS OR IMPLIED WARRANTY, INCLUDING OF MERCHANTABILITY, SATISFACTORY QUALITY AND FITNESS FOR A PARTICULAR PURPOSE. Please see the CERN OHL v.2.0 for applicable conditions.
- Contact
- File
- Last Mod.
- Print Date
- Sheet
- Size
- A3
- of
- Rev
- (in symbol CTE3528-12_47UF_10V_20%_PANASONIC_TPG) +
- (in symbol R0402_4K7_1%_0.0625W_100PPM) 1%
- (in symbol R0805_300R_0.05%_0.125W_10PPM) 0.05%

### Library data of the parts
C54 C64 = CTE3528-12_47UF_10V_20%_PANASONIC_TPG: Polarised capacitor; Part Description: ESR 0R07 Solid Tantalum Chip Capacitor; Manufacturer Part Number: 10TPG47M; Voltage: 10V; Tolerance: ±20%; Part Number: CTE3528-12_47UF_10V_20%_PANASONIC_TPG; Component Kind: Standard; Component Type: Standard; Pin Count: 2; Value: 47uF; Status: None; Manufacturer: PANASONIC; Case: T; Mounted: Yes; Socket: No; SMD: Yes; Sense: No; ComponentHeight: 1.2mm; HelpURL: \\cern.ch\dfs\Applications\Altium\Datasheets\CTE_PANASONIC_TPG.pdf; Author: CERN DEM JLC; CreateDate: 01.09.2014; LatestRevisionDate: 01.09.2014
C90 = CC0402_220NF_16V_10%_X7R: as C21 on sheet Integrators; Part Number: CC0402_220NF_16V_10%_X7R; Component Kind: Standard; Component Type: Standard; Pin Count: 2; Value: 220nF; Status: Preferred; Manufacturer Part Number: CC0402_220NF_16V_10%_X7R; Case: 0402; Mounted: Yes; Socket: No; SMD: Yes; Sense: No; Manufacturer1 Example: TDK; Manufacturer1 ComponentHeight: 0.55mm; HelpURL: \\cern.ch\dfs\Applications\Altium\Datasheets\CC0402_X7R_TDK_C.pdf; Author: CERN DEM JLC; CreateDate: 25.10.2012; LatestRevisionDate: 25.10.2012
C131 = CC0805_220NF_50V_10%_X7R: Non-polarised capacitor; Part Description: SMD Multilayer Chip Ceramic Capacitor; Manufacturer: GENERIC; Manufacturer1 Part Number: GRM21BR71H224KA01L; Voltage: 50V; TC: X7R; Tolerance: ±10%; Part Number: CC0805_220NF_50V_10%_X7R; Component Kind: Standard; Component Type: Standard; Pin Count: 2; Value: 220nF; Status: Preferred; Manufacturer Part Number: CC0805_220NF_50V_10%_X7R; Case: 0805; Mounted: Yes; Socket: No; SMD: Yes; Sense: No; Manufacturer1 Example: MURATA; Manufacturer1 ComponentHeight: 1.35mm; HelpURL: \\cern.ch\dfs\Applications\Altium\Datasheets\CC0805_X7R_MURATA.pdf; Author: CERN DEM JLC; CreateDate: 03.12.2007; LatestRevisionDate: 03.12.2007
DA1 = OPA4350EA: Quad Operational Amplifier; Part Description: Quad, High-Speed, Single-Supply, Rail-to-Rail Operational Amplifiers MicroAmplifier Series; Manufacturer: TEXAS INSTRUMENTS; PressFit: No; Bonding: No; Part Number: OPA4350EA; Component Kind: Standard; Component Type: Standard; Device: OPA4350EA; PackageDescription: SOP, 0.635mm Pitch; 16 Pin, 3.9mm W X 4.895mm L X 1.75mm H body, IPC Medium Density; Manufacturer Part Number: OPA4350EA; Pin Count: 16; Case: SSOP16; Mounted: Yes; Socket: No; SMD: Yes; Sense: No; ComponentHeight: 1.75mm; Author: CERN DEM HF; HelpURL: \\cern.ch\dfs\Applications\Altium\Datasheets\OPA4350EA.pdf; CreateDate: 08.05.2024; LatestRevisionDate: 08.05.2024
DA17 = REF191ES: Precision Micropower, Low Dropout Voltage Reference; Part Description: 2.048V Precision Micropower, Low Dropout Voltage Reference, 5ppm/°C, −40°C to +85°C; Manufacturer: ANALOG DEVICES; PressFit: No; Bonding: No; Part Number: REF191ES; Component Kind: Standard; Component Type: Standard; Device: REF191ES; PackageDescription: SOIC 8, Pitch 1.27mm, Body 4x5mm, IPC Medium Density; Manufacturer Part Number: REF191ES; Pin Count: 8; Case: SOIC8; Mounted: Yes; Socket: No; SMD: Yes; Sense: No; ComponentHeight: 1.75mm; HelpURL: \\cern.ch\dfs\Applications\Altium\Datasheets\REF19x_Series.pdf; Author: CERN DEM HF; CreateDate: 17.05.2024; LatestRevisionDate: 17.05.2024
DA22 = DAC8554IPW: 16-Bit, Quad-Channel, Uultra-Low Glitch, Voltage Output Digital-to-Analog Converter; Manufacturer: TEXAS INSTRUMENTS; PressFit: No; Bonding: No; Part Number: DAC8554IPW; Component Kind: Standard; Component Type: Standard; Device: DAC8554IPW; PackageDescription: SOP, 0.65mm Pitch; 16 Pin, 4.40mm W X 5.00mm L X 1.10mm H body, IPC Medium Density; Part Description: 16-Bit, Quad-Channel, Uultra-Low Glitch, Voltage Output Digital-to-Analog Converter; Manufacturer Part Number: DAC8554IPW; Pin Count: 16; Case: TSSOP16; Mounted: Yes; Socket: No; SMD: Yes; Sense: No; ComponentHeight: 1.1mm; Author: CERN DEM HF; HelpURL: \\cern.ch\dfs\Applications\Altium\Datasheets\DAC8554.pdf; CreateDate: 07.05.2024; LatestRevisionDate: 07.05.2024
R31 R41 = R0402_100R_0.1%_1W_25PPM_VISHAY_FCHP0402E1000BS: as R40 on sheet Integrators; Part Number: R0402_100R_0.1%_1W_25PPM_VISHAY_FCHP0402E1000BS; Component Kind: Standard; Component Type: Standard; Pin Count: 2; Value: 100; Status: Not Recommended; Manufacturer Part Number: FCHP0402E1000BS; Case: 0402; Mounted: Yes; Sense: No; Socket: No; SMD: Yes; ComponentHeight: 0.38mm; HelpURL: \\cern.ch\dfs\Applications\Altium\Datasheets\R0402_VISHAY_FCHP.pdf; Author: CERN DEM HF; CreateDate: 04.04.2023; LatestRevisionDate: 04.04.2023
R34 = R0805_10K_0.1%_0.1W_10PPM: Resistor - 0.1%; Part Description: Thin Film Chip Resistor; Manufacturer: GENERIC; Manufacturer1 Part Number: RN73C2A10KBTG; Power: 0.1W; TC: ±10ppm; PressFit: No; Part Number: R0805_10K_0.1%_0.1W_10PPM; Component Kind: Standard; Component Type: Standard; Pin Count: 2; Value: 10k; Status: Not Recommended; Manufacturer Part Number: R0805_10K_0.1%_0.1W_10PPM; Case: 0805; Mounted: Yes; Sense: No; Socket: No; SMD: Yes; Manufacturer1 Example: TYCO HOLSWORTHY; Manufacturer1 ComponentHeight: 0.6mm; HelpURL: \\cern.ch\dfs\Applications\Altium\Datasheets\R0805_Tyco_RN73.pdf; Author: CERN DEM JLC; CreateDate: 03.12.2007; LatestRevisionDate: 13.03.2008
R39 R42 R44 R46 = R0805_300R_0.05%_0.125W_10PPM: Resistor - 0.05%; Part Description: Thin Film Chip Resistor; Manufacturer: GENERIC; Manufacturer1 Part Number: RG2012N-301-W; Power: 0.125W; TC: ±10ppm/°C; PressFit: No; Part Number: R0805_300R_0.05%_0.125W_10PPM; Component Kind: Standard; Component Type: Standard; Pin Count: 2; Value: 300; Status: Not Recommended; Tolerance: ±0.05%; Manufacturer Part Number: R0805_300R_0.05%_0.125W_10PPM; Case: 0805; Mounted: Yes; Sense: No; Socket: No; SMD: Yes; Manufacturer1 Example: SUSUMU; Manufacturer1 ComponentHeight: 0.5mm; HelpURL: \\cern.ch\dfs\Applications\Altium\Datasheets\R0805_SUSUMU_RG.pdf; Author: CERN DEM HF; CreateDate: 24.06.2024; LatestRevisionDate: 24.06.2024
R45x R122x = R0805_5K1_0.1%_0.1W_25PPM: Resistor - 0.1%; Part Description: Precision Surface Mount Resistor; Manufacturer: GENERIC; Manufacturer1 Part Number: PCF0805R-5K1BT1; Power: 0.1W; TC: ±25ppm/°C; PressFit: No; Part Number: R0805_5K1_0.1%_0.1W_25PPM; Component Kind: Standard; Component Type: Standard; Pin Count: 2; Value: 5k1; Status: Not Recommended; Manufacturer Part Number: R0805_5K1_0.1%_0.1W_25PPM; Case: 0805; Mounted: Yes; Sense: No; Socket: No; SMD: Yes; Manufacturer1 Example: TT ELECTRONICS; Manufacturer1 ComponentHeight: 0.5mm; HelpURL: \\cern.ch\dfs\Applications\Altium\Datasheets\R0805_TT ELECTRONICS_PCF.pdf; Author: CERN DEM JLC; CreateDate: 03.11.2010; LatestRevisionDate: 25.10.2018
R82 = R0805_10R_0.1%_0.1W_10PPM: as R56 on sheet Integrators; Part Number: R0805_10R_0.1%_0.1W_10PPM; Component Kind: Standard; Component Type: Standard; Pin Count: 2; Value: 10; Status: Not Recommended; Manufacturer Part Number: R0805_10R_0.1%_0.1W_10PPM; Case: 0805; Mounted: Yes; Sense: No; Socket: No; SMD: Yes; Manufacturer1 Example: TYCO HOLSWORTHY; Manufacturer1 ComponentHeight: 0.6mm; HelpURL: \\cern.ch\dfs\Applications\Altium\Datasheets\R0805_Tyco_RN73.pdf; Author: CERN DEM JLC; CreateDate: 03.12.2007; LatestRevisionDate: 13.03.2008
R121x = R0402_4K7_1%_0.0625W_100PPM: Resistor - 1%; Part Description: General Purpose Thick Film Chip Resistor; Manufacturer: GENERIC; Manufacturer1 Part Number: 232270674702L; TC: ±100ppm/°C; PressFit: No; Part Number: R0402_4K7_1%_0.0625W_100PPM; Component Kind: Standard; Component Type: Standard; Pin Count: 2; Value: 4k7; Status: Not Recommended; Power: 0.0625W; Tolerance: ±1%; Manufacturer Part Number: R0402_4K7_1%_0.0625W_100PPM; Case: 0402; Mounted: Yes; Sense: No; Socket: No; SMD: Yes; Manufacturer1 Example: YAGEO PHYCOMP; Manufacturer1 ComponentHeight: 0.4mm; HelpURL: \\cern.ch\dfs\Applications\Altium\Datasheets\R0402_Phycomp_RC0402.pdf; Author: CERN DEM JLC; CreateDate: 03/12/2007; LatestRevisionDate: 17/10/2012
X2 = DW-10-X-X-S-X: MF: Samtec; Value: *; Availability: Unavailable; Price: None; Package: None; Manufacturer Part Number: DW-10-09-L-S-470